# Altium project CONTROLLER_30.PrjPcb (part 1 of 3)
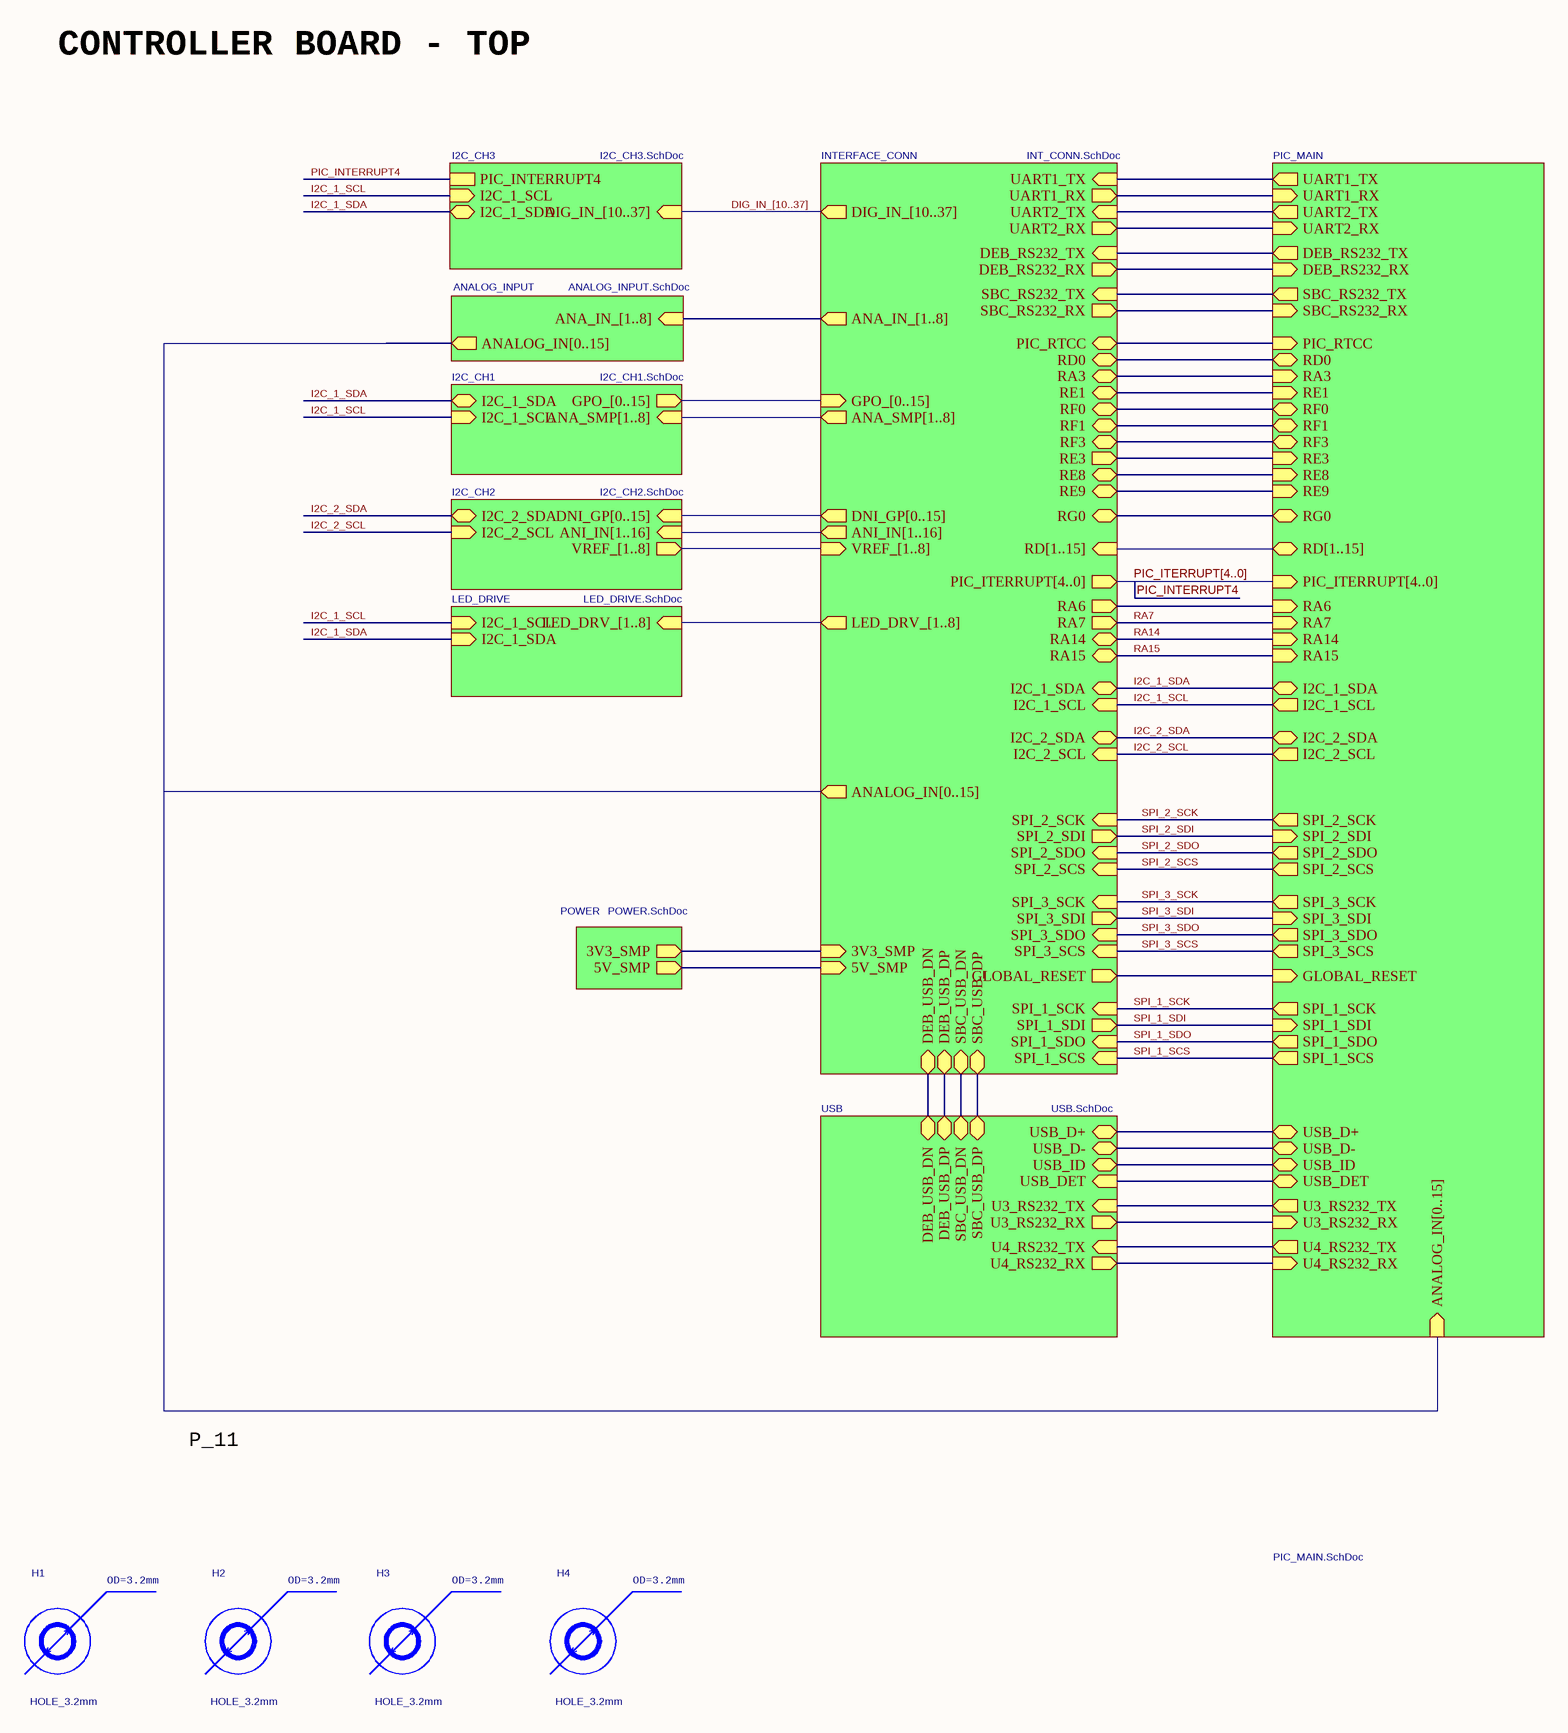
[diagram p0: CONTROLLER_TOP.SchDoc]
Approved_Date: 15/12/19; Designed_Date: 01/12/19; Reviewed_Date: 08/12/19
14 sheets, 671 parts. Net scope: hierarchical (ports join the sheet entries above them; power ports are global).
Board file: CONTROLLER-2_BRD2.PcbDoc
Sheets:
  CONTROLLER_TOP.SchDoc
    USB = USB.SchDoc
    LED_DRIVE = LED_DRIVE.SchDoc
    PIC_MAIN = PIC_MAIN.SchDoc
      PIC_BLOCK = PIC_BLOCK.SchDoc
        PIC_RS232 = PIC_RS232.SchDoc
        PIC_CONTROLLER = PIC_CONTROLLER.SchDoc
        PIC_POWER_MISC = PIC_POWER_MISC.SchDoc
    ANALOG_INPUT = ANALOG_INPUT.SchDoc
    POWER = POWER.SchDoc
    I2C_CH2 = I2C_CH2.SchDoc
    I2C_CH3 = I2C_CH3.SchDoc
    INTERFACE_CONN = INT_CONN.SchDoc
    I2C_CH1 = I2C_CH1.SchDoc

## Sheet CONTROLLER_TOP.SchDoc
size A3; ApprovedBy: D. Grossman; CheckedBy: G. Engel; Author: Y. Yakov; CompanyName: LightSense; DrawnBy: Y. Yakov; Engineer: Y.Yakov; Organization: LightSense

### Parts
H1  HOLE_3.2mm  [HOLE_3.2mm]
H2  HOLE_3.2mm  [HOLE_3.2mm]
H3  HOLE_3.2mm  [HOLE_3.2mm]
H4  HOLE_3.2mm  [HOLE_3.2mm]

### Sub-sheets
ANALOG_INPUT = ANALOG_INPUT.SchDoc: ANA_IN_[1..8] (in), ANALOG_IN[0..15] (out)
I2C_CH1 = I2C_CH1.SchDoc: I2C_1_SDA (bidir), I2C_1_SCL (in), ANA_SMP[1..8] (in), GPO_[0..15] (out)
I2C_CH2 = I2C_CH2.SchDoc: I2C_2_SCL (in), I2C_2_SDA (bidir), ANI_IN[1..16] (in), DNI_GP[0..15] (in), VREF_[1..8] (out)
I2C_CH3 = I2C_CH3.SchDoc: I2C_1_SCL (in), I2C_1_SDA (bidir), DIG_IN_[10..37] (in), PIC_INTERRUPT4
INTERFACE_CONN = INT_CONN.SchDoc: I2C_2_SDA (bidir), I2C_2_SCL (in), I2C_1_SDA (bidir), I2C_1_SCL (in), RE1 (bidir), RE8 (bidir), RE9 (bidir), RA15 (bidir), RA14 (bidir), PIC_RTCC (bidir), SBC_RS232_TX (in), DEB_RS232_RX (out), SBC_RS232_RX (out), SPI_2_SCK (in), SPI_3_SCK (in), SPI_2_SDI (out), SPI_3_SDI (out), SPI_2_SDO (in), SPI_3_SDO (in), SPI_2_SCS (in), SPI_3_SCS (in), RD0 (bidir), RF0 (bidir), RF1 (bidir), RF3 (bidir), RE3 (out), RA3 (bidir), SBC_USB_DP (bidir), SBC_USB_DN (bidir), DEB_USB_DP (bidir), DEB_USB_DN (bidir), LED_DRV_[1..8] (out), ANA_SMP[1..8] (out), GPO_[0..15] (in), ANI_IN[1..16] (out), VREF_[1..8] (in), RA7 (out), UART1_TX (in), UART2_TX (in), UART1_RX (out), UART2_RX (out), SPI_1_SCK (in), SPI_1_SDO (in), SPI_1_SCS (in), SPI_1_SDI (out), RG0 (bidir), PIC_ITERRUPT[4..0] (out), DNI_GP[0..15] (out), GLOBAL_RESET (out), ANA_IN_[1..8] (out), RA6 (out), DEB_RS232_TX (in), ANALOG_IN[0..15] (out), DIG_IN_[10..37] (out), RD[1..15] (in), 3V3_SMP (in), 5V_SMP (in)
LED_DRIVE = LED_DRIVE.SchDoc: I2C_1_SCL (in), I2C_1_SDA (in), LED_DRV_[1..8] (in)
PIC_MAIN = PIC_MAIN.SchDoc: USB_D- (bidir), PIC_ITERRUPT[4..0] (in), GLOBAL_RESET (in), USB_D+ (bidir), SPI_3_SDO (out), SPI_3_SCS (out), SPI_3_SDI (in), SPI_1_SCS (out), SPI_3_SCK (out), SPI_1_SDO (out), SPI_1_SCK (out), SPI_1_SDI (in), I2C_1_SDA (bidir), I2C_2_SDA (bidir), I2C_1_SCL (out), I2C_2_SCL (out), SBC_RS232_RX (in), SBC_RS232_TX (out), DEB_RS232_TX (out), RF0 (bidir), RF1 (bidir), RF3 (bidir), USB_ID (bidir), USB_DET (bidir), U3_RS232_RX (in), U3_RS232_TX (out), U4_RS232_RX (in), U4_RS232_TX (out), SPI_2_SCS (out), SPI_2_SDO (out), SPI_2_SCK (out), SPI_2_SDI (in), RD0 (bidir), RE1 (in), RE3 (in), UART1_RX (in), UART2_RX (in), UART1_TX (out), UART2_TX (out), RA7 (in), RE9 (in), RE8 (in), RA14 (in), RA15 (in), PIC_RTCC (in), RA6 (in), RA3 (in), RG0 (bidir), DEB_RS232_RX (in), ANALOG_IN[0..15] (in), RD[1..15] (bidir)
POWER = POWER.SchDoc: 5V_SMP (out), 3V3_SMP (out)
USB = USB.SchDoc: USB_D- (bidir), USB_D+ (bidir), U4_RS232_TX (in), U4_RS232_RX (out), U3_RS232_RX (out), U3_RS232_TX (in), SBC_USB_DP (bidir), SBC_USB_DN (bidir), DEB_USB_DP (bidir), DEB_USB_DN (bidir), USB_DET (in), USB_ID (bidir)

### Nets
3V3_SMP: sheet POWER/3V3_SMP, sheet INTERFACE_CONN/3V3_SMP
5V_SMP: sheet POWER/5V_SMP, sheet INTERFACE_CONN/5V_SMP
DEB_RS232_RX: sheet PIC_MAIN/DEB_RS232_RX, sheet INTERFACE_CONN/DEB_RS232_RX
DEB_RS232_TX: sheet PIC_MAIN/DEB_RS232_TX, sheet INTERFACE_CONN/DEB_RS232_TX
DEB_USB_DN: sheet USB/DEB_USB_DN, sheet INTERFACE_CONN/DEB_USB_DN
DEB_USB_DP: sheet USB/DEB_USB_DP, sheet INTERFACE_CONN/DEB_USB_DP
GLOBAL_RESET: sheet PIC_MAIN/GLOBAL_RESET, sheet INTERFACE_CONN/GLOBAL_RESET
I2C_1_SCL: sheet LED_DRIVE/I2C_1_SCL, sheet PIC_MAIN/I2C_1_SCL, sheet I2C_CH3/I2C_1_SCL, sheet INTERFACE_CONN/I2C_1_SCL, sheet I2C_CH1/I2C_1_SCL
I2C_1_SDA: sheet LED_DRIVE/I2C_1_SDA, sheet PIC_MAIN/I2C_1_SDA, sheet I2C_CH3/I2C_1_SDA, sheet INTERFACE_CONN/I2C_1_SDA, sheet I2C_CH1/I2C_1_SDA
I2C_2_SCL: sheet PIC_MAIN/I2C_2_SCL, sheet I2C_CH2/I2C_2_SCL, sheet INTERFACE_CONN/I2C_2_SCL
I2C_2_SDA: sheet PIC_MAIN/I2C_2_SDA, sheet I2C_CH2/I2C_2_SDA, sheet INTERFACE_CONN/I2C_2_SDA
PIC_RTCC: sheet PIC_MAIN/PIC_RTCC, sheet INTERFACE_CONN/PIC_RTCC
RA3: sheet PIC_MAIN/RA3, sheet INTERFACE_CONN/RA3
RA6: sheet PIC_MAIN/RA6, sheet INTERFACE_CONN/RA6
RA7: sheet PIC_MAIN/RA7, sheet INTERFACE_CONN/RA7
RA14: sheet PIC_MAIN/RA14, sheet INTERFACE_CONN/RA14
RA15: sheet PIC_MAIN/RA15, sheet INTERFACE_CONN/RA15
RD0: sheet PIC_MAIN/RD0, sheet INTERFACE_CONN/RD0
RE1: sheet PIC_MAIN/RE1, sheet INTERFACE_CONN/RE1
RE3: sheet PIC_MAIN/RE3, sheet INTERFACE_CONN/RE3
RE8: sheet PIC_MAIN/RE8, sheet INTERFACE_CONN/RE8
RE9: sheet PIC_MAIN/RE9, sheet INTERFACE_CONN/RE9
RF0: sheet PIC_MAIN/RF0, sheet INTERFACE_CONN/RF0
RF1: sheet PIC_MAIN/RF1, sheet INTERFACE_CONN/RF1
RF3: sheet PIC_MAIN/RF3, sheet INTERFACE_CONN/RF3
RG0: sheet PIC_MAIN/RG0, sheet INTERFACE_CONN/RG0
SBC_RS232_RX: sheet PIC_MAIN/SBC_RS232_RX, sheet INTERFACE_CONN/SBC_RS232_RX
SBC_RS232_TX: sheet PIC_MAIN/SBC_RS232_TX, sheet INTERFACE_CONN/SBC_RS232_TX
SBC_USB_DN: sheet USB/SBC_USB_DN, sheet INTERFACE_CONN/SBC_USB_DN
SBC_USB_DP: sheet USB/SBC_USB_DP, sheet INTERFACE_CONN/SBC_USB_DP
SPI_1_SCK: sheet PIC_MAIN/SPI_1_SCK, sheet INTERFACE_CONN/SPI_1_SCK
SPI_1_SCS: sheet PIC_MAIN/SPI_1_SCS, sheet INTERFACE_CONN/SPI_1_SCS
SPI_1_SDI: sheet PIC_MAIN/SPI_1_SDI, sheet INTERFACE_CONN/SPI_1_SDI
SPI_1_SDO: sheet PIC_MAIN/SPI_1_SDO, sheet INTERFACE_CONN/SPI_1_SDO
SPI_2_SCK: sheet PIC_MAIN/SPI_2_SCK, sheet INTERFACE_CONN/SPI_2_SCK
SPI_2_SCS: sheet PIC_MAIN/SPI_2_SCS, sheet INTERFACE_CONN/SPI_2_SCS
SPI_2_SDI: sheet PIC_MAIN/SPI_2_SDI, sheet INTERFACE_CONN/SPI_2_SDI
SPI_2_SDO: sheet PIC_MAIN/SPI_2_SDO, sheet INTERFACE_CONN/SPI_2_SDO
SPI_3_SCK: sheet PIC_MAIN/SPI_3_SCK, sheet INTERFACE_CONN/SPI_3_SCK
SPI_3_SCS: sheet PIC_MAIN/SPI_3_SCS, sheet INTERFACE_CONN/SPI_3_SCS
SPI_3_SDI: sheet PIC_MAIN/SPI_3_SDI, sheet INTERFACE_CONN/SPI_3_SDI
SPI_3_SDO: sheet PIC_MAIN/SPI_3_SDO, sheet INTERFACE_CONN/SPI_3_SDO
U3_RS232_RX: sheet USB/U3_RS232_RX, sheet PIC_MAIN/U3_RS232_RX
U3_RS232_TX: sheet USB/U3_RS232_TX, sheet PIC_MAIN/U3_RS232_TX
U4_RS232_RX: sheet USB/U4_RS232_RX, sheet PIC_MAIN/U4_RS232_RX
U4_RS232_TX: sheet USB/U4_RS232_TX, sheet PIC_MAIN/U4_RS232_TX
UART1_RX: sheet PIC_MAIN/UART1_RX, sheet INTERFACE_CONN/UART1_RX
UART1_TX: sheet PIC_MAIN/UART1_TX, sheet INTERFACE_CONN/UART1_TX
UART2_RX: sheet PIC_MAIN/UART2_RX, sheet INTERFACE_CONN/UART2_RX
UART2_TX: sheet PIC_MAIN/UART2_TX, sheet INTERFACE_CONN/UART2_TX
USB_D+: sheet USB/USB_D+, sheet PIC_MAIN/USB_D+
USB_D-: sheet USB/USB_D-, sheet PIC_MAIN/USB_D-
USB_DET: sheet USB/USB_DET, sheet PIC_MAIN/USB_DET
USB_ID: sheet USB/USB_ID, sheet PIC_MAIN/USB_ID

### Buses and harness runs
bus DIG_IN_[10..37] = sheet I2C_CH3/DIG_IN_[10..37] = sheet INTERFACE_CONN/DIG_IN_[10..37]
bus PIC_ITERRUPT[4..0] = sheet INTERFACE_CONN/PIC_ITERRUPT[4..0] = sheet PIC_MAIN/PIC_ITERRUPT[4..0]
bus sheet ANALOG_INPUT/ANA_IN_[1..8] = sheet INTERFACE_CONN/ANA_IN_[1..8]
bus sheet I2C_CH1/ANA_SMP[1..8] = sheet INTERFACE_CONN/ANA_SMP[1..8]
bus sheet I2C_CH1/GPO_[0..15] = sheet INTERFACE_CONN/GPO_[0..15]
bus sheet I2C_CH2/ANI_IN[1..16] = sheet INTERFACE_CONN/ANI_IN[1..16]
bus sheet I2C_CH2/DNI_GP[0..15] = sheet INTERFACE_CONN/DNI_GP[0..15]
bus sheet I2C_CH2/VREF_[1..8] = sheet INTERFACE_CONN/VREF_[1..8]
bus sheet INTERFACE_CONN/ANALOG_IN[0..15] = sheet PIC_MAIN/ANALOG_IN[0..15]
bus sheet INTERFACE_CONN/LED_DRV_[1..8] = sheet LED_DRIVE/LED_DRV_[1..8]
bus sheet INTERFACE_CONN/RD[1..15] = sheet PIC_MAIN/RD[1..15]

### Notes on the sheet
- CONTROLLER BOARD - TOP
- P_11
- Description:
- Sheet
- of
- Designed
- Name
- Signature
- Date
- File:
- This drawing and any accompanying documents contain confidential information intended for a specific individual and purpose.
  This information, owned by Lightsense, is private and confidential. If you are not the intended recipient, you are hereby notified that any disclosure, copying or distribution, or the taking of any action based on the contents of this information, is strictly prohibited.
- Board Name:
- Document Version:
- Approved
- Reviewed
- (in symbol HOLE_3.2mm) OD=3.2mm

## Sheet USB.SchDoc
size A3; ApprovedBy: D. Grossman; CheckedBy: G. Engel; Author: Y. Yakov; CompanyName: LightSense; DrawnBy: Y. Yakov; Engineer: Y.Yakov; Organization: LightSense
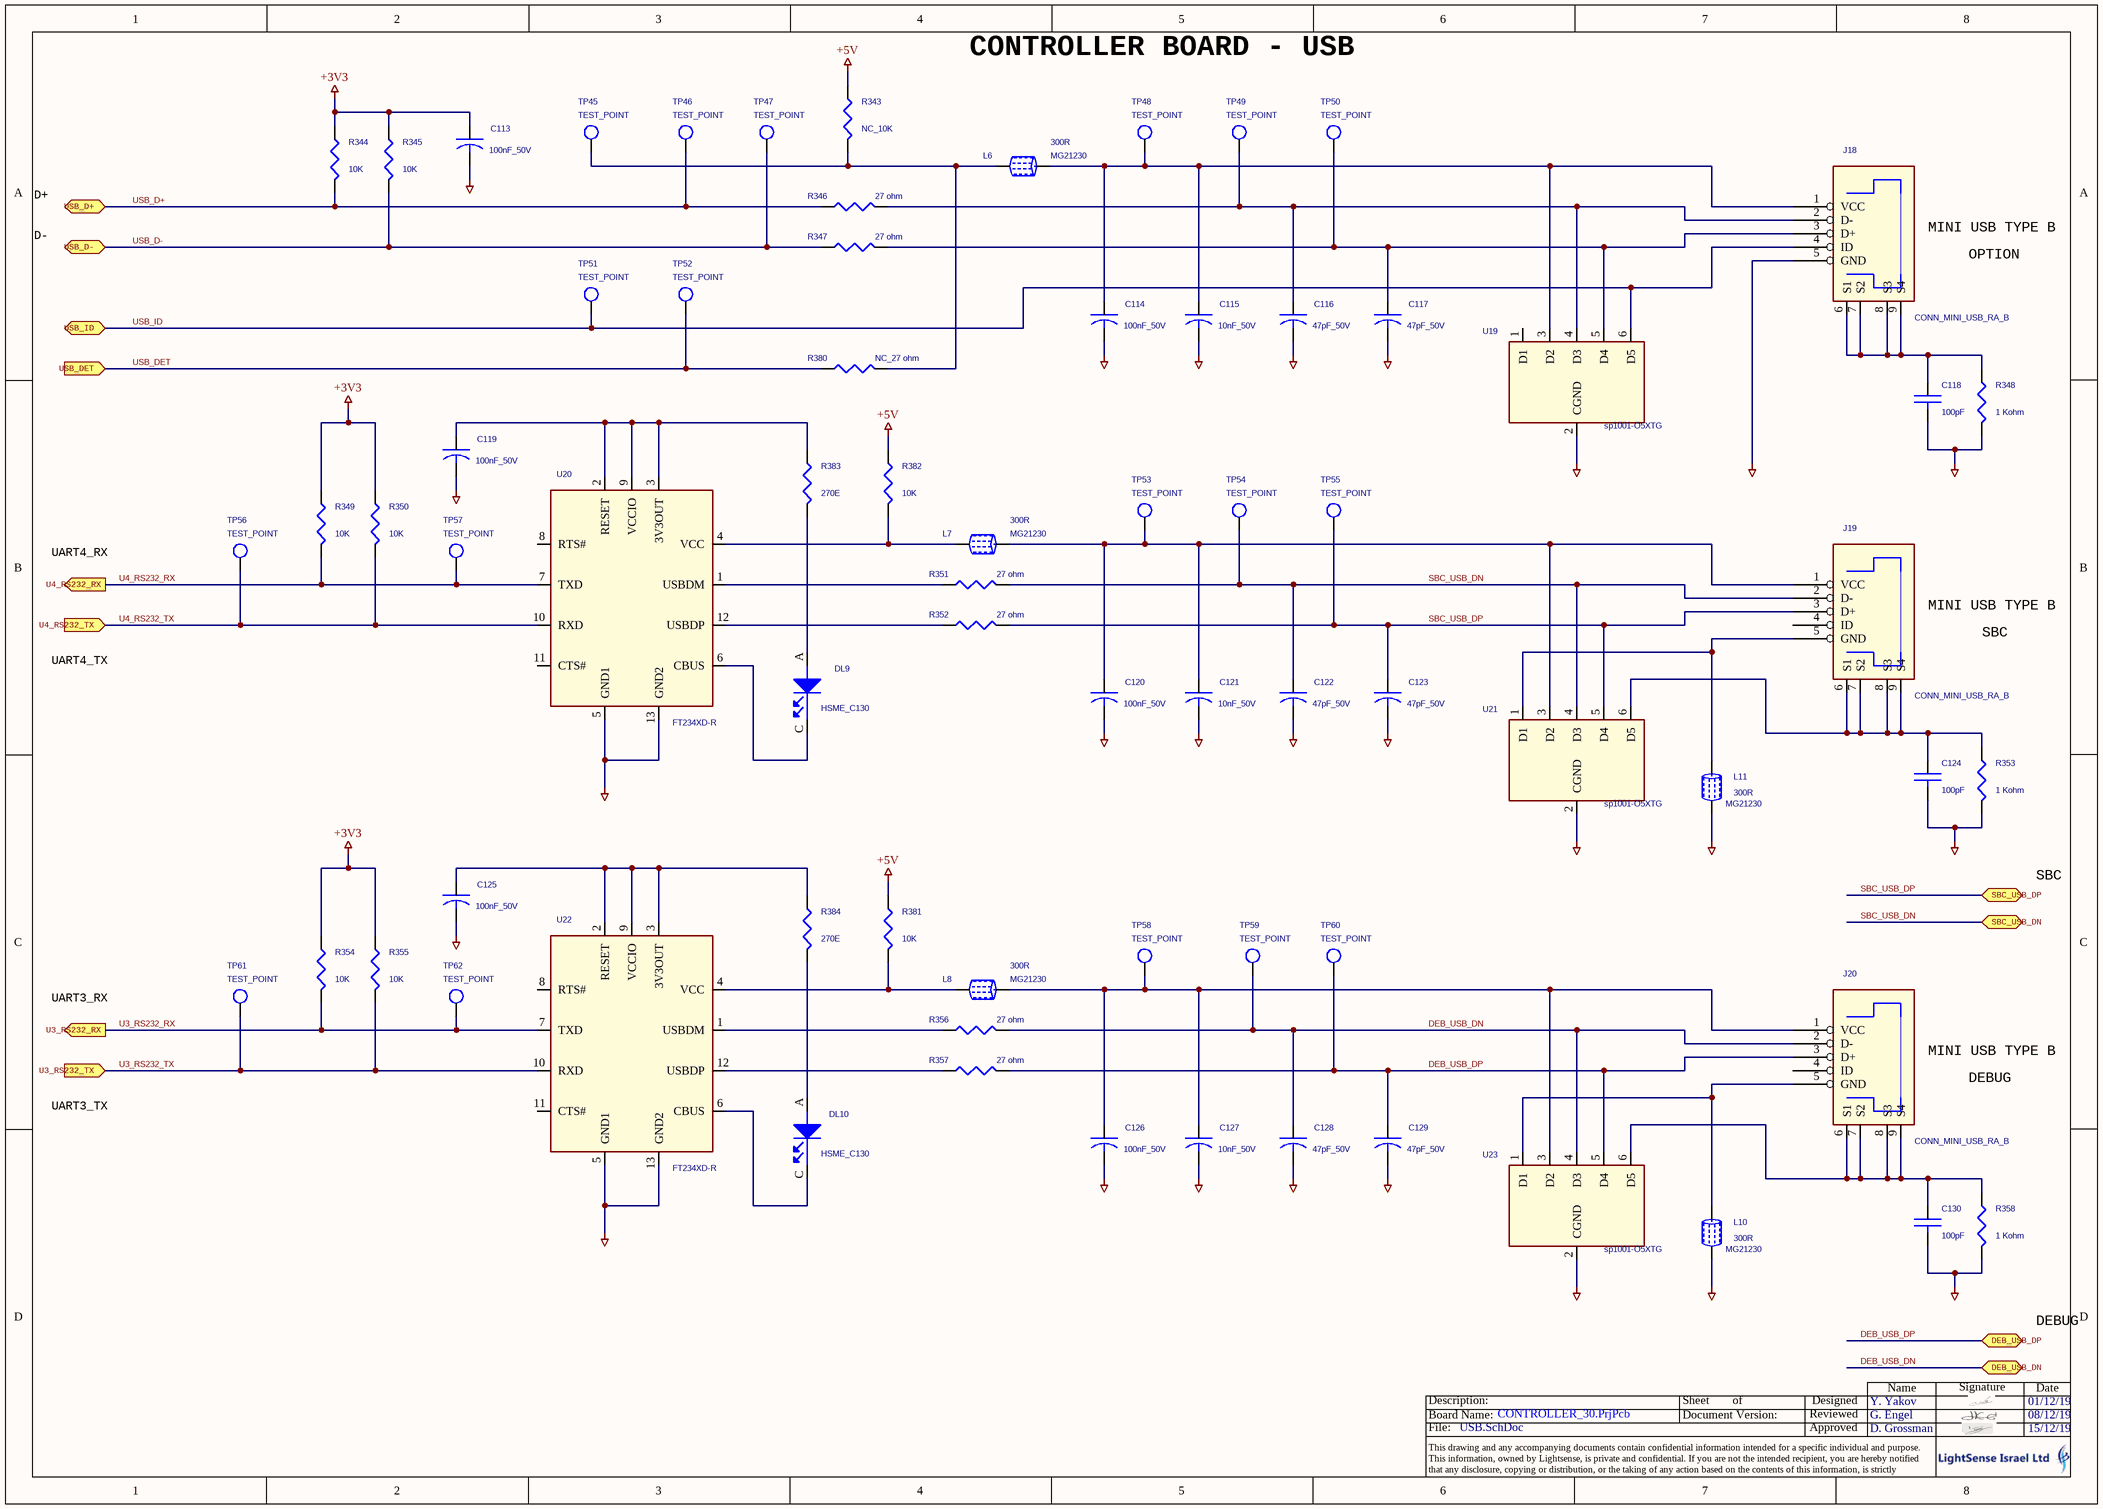
[diagram p1: USB.SchDoc]

### Parts
C113  100nF_50V  [0603]
C114  100nF_50V  [0603]
C115  10nF_50V  [0603]
C116  47pF_50V  [0603]
C117  47pF_50V  [0603]
C118  100pF  [C1206]
C119  100nF_50V  [0603]
C120  100nF_50V  [0603]
C121  10nF_50V  [0603]
C122  47pF_50V  [0603]
C123  47pF_50V  [0603]
C124  100pF  [C1206]
C125  100nF_50V  [0603]
C126  100nF_50V  [0603]
C127  10nF_50V  [0603]
C128  47pF_50V  [0603]
C129  47pF_50V  [0603]
C130  100pF  [C1206]
DL9  HSME_C130  [LED_0603]
DL10  HSME_C130  [LED_0603]
J18  CONN_MINI_USB_RA_B  [MUSB_B_9PIN]
J19  CONN_MINI_USB_RA_B  [MUSB_B_9PIN]
J20  CONN_MINI_USB_RA_B  [MUSB_B_9PIN]
L6  300R  Part_Number: MG21230  [B0603]
L7  300R  Part_Number: MG21230  [B0603]
L8  300R  Part_Number: MG21230  [B0603]
L10  300R  Part_Number: MG21230  [B0603]
L11  300R  Part_Number: MG21230  [B0603]
R343  NC_10K  [0603]
R344  10K  [0603]
R345  10K  [0603]
R346  27 ohm  [R0603]
R347  27 ohm  [R0603]
R348  1 Kohm  [R1206]
R349  10K  [0603]
R350  10K  [0603]
R351  27 ohm  [R0603]
R352  27 ohm  [R0603]
R353  1 Kohm  [R1206]
R354  10K  [0603]
R355  10K  [0603]
R356  27 ohm  [R0603]
R357  27 ohm  [R0603]
R358  1 Kohm  [R1206]
R380  NC_27 ohm  [R0603]
R381  10K  [0603]
R382  10K  [0603]
R383  270E  [0603]
R384  270E  [0603]
TP45  TEST_POINT  [TH_1mm]
TP46  TEST_POINT  [TH_1mm]
TP47  TEST_POINT  [TH_1mm]
TP48  TEST_POINT  [TH_1mm]
TP49  TEST_POINT  [TH_1mm]
TP50  TEST_POINT  [TH_1mm]
TP51  TEST_POINT  [TH_1mm]
TP52  TEST_POINT  [TH_1mm]
TP53  TEST_POINT  [TH_1mm]
TP54  TEST_POINT  [TH_1mm]
TP55  TEST_POINT  [TH_1mm]
TP56  TEST_POINT  [TH_1mm]
TP57  TEST_POINT  [TH_1mm]
TP58  TEST_POINT  [TH_1mm]
TP59  TEST_POINT  [TH_1mm]
TP60  TEST_POINT  [TH_1mm]
TP61  TEST_POINT  [TH_1mm]
TP62  TEST_POINT  [TH_1mm]
U19  sp1001-O5XTG  [SOT_563]
U20  FT234XD-R  [DFN_13]
U21  sp1001-O5XTG  [SOT_563]
U22  FT234XD-R  [DFN_13]
U23  sp1001-O5XTG  [SOT_563]

### Ports
DEB_USB_DN (bidir), DEB_USB_DP (bidir), SBC_USB_DN (bidir), SBC_USB_DP (bidir), U3_RS232_RX (out), U3_RS232_TX (in), U4_RS232_RX (out), U4_RS232_TX (in), USB_D+ (bidir), USB_D- (bidir), USB_DET (in), USB_ID (bidir)

### Nets
+3V3: C113.1 R344.1 R345.1 R349.1 R350.1 R354.1 R355.1
+5V: R343.1 R381.1 R382.1
GND_CPU: C113.2 C114.2 C115.2 C116.2 C117.2 C118.2 C119.2 C120.2 C121.2 C122.2 C123.2 C124.2 C125.2 C126.2 C127.2 C128.2 C129.2 C130.2 J18.5(GND) L10.1 L11.1 R348.2 R353.2 R358.2 U19.2(CGND) U20.5(GND1) U20.13(GND2) U21.2(CGND) U22.5(GND1) U22.13(GND2) U23.2(CGND)
DEB_USB_DN: C128.1 J20.2(D-) R356.2 TP59.1(TP) U23.4(D3) ; port DEB_USB_DN
DEB_USB_DP: C129.1 J20.3(D+) R357.2 TP60.1(TP) U23.5(D4) ; port DEB_USB_DP
SBC_USB_DN: C122.1 J19.2(D-) R351.2 TP54.1(TP) U21.4(D3) ; port SBC_USB_DN
SBC_USB_DP: C123.1 J19.3(D+) R352.2 TP55.1(TP) U21.5(D4) ; port SBC_USB_DP
U3_RS232_RX: R354.2 TP62.1(TP) U22.7(TXD) ; port U3_RS232_RX
U3_RS232_TX: R355.2 TP61.1(TP) U22.10(RXD) ; port U3_RS232_TX
U4_RS232_RX: R349.2 TP57.1(TP) U20.7(TXD) ; port U4_RS232_RX
U4_RS232_TX: R350.2 TP56.1(TP) U20.10(RXD) ; port U4_RS232_TX
USB_D+: R344.2 R346.1 TP46.1(TP) ; port USB_D+
USB_D-: R345.2 R347.1 TP47.1(TP) ; port USB_D-
USB_DET: R380.1 TP52.1(TP) ; port USB_DET
USB_ID: J18.4(ID) TP51.1(TP) U19.6(D5) ; port USB_ID
NetC114_1: C114.1 C115.1 J18.1(VCC) L6.2 TP48.1(TP) U19.3(D2)
NetC116_1: C116.1 J18.2(D-) R346.2 TP49.1(TP) U19.4(D3)
NetC117_1: C117.1 J18.3(D+) R347.2 TP50.1(TP) U19.5(D4)
NetC118_1: C118.1 J18.6(S1) J18.7(S2) J18.8(S3) J18.9(S4) R348.1
NetC119_1: C119.1 R383.1 U20.2(RESET) U20.3(3V3OUT) U20.9(VCCIO)
NetC120_1: C120.1 C121.1 J19.1(VCC) L7.2 TP53.1(TP) U21.3(D2)
NetC124_1: C124.1 J19.6(S1) J19.7(S2) J19.8(S3) J19.9(S4) R353.1 U21.6(D5)
NetC125_1: C125.1 R384.1 U22.2(RESET) U22.3(3V3OUT) U22.9(VCCIO)
NetC126_1: C126.1 C127.1 J20.1(VCC) L8.2 TP58.1(TP) U23.3(D2)
NetC130_1: C130.1 J20.6(S1) J20.7(S2) J20.8(S3) J20.9(S4) R358.1 U23.6(D5)
NetDL9_A: DL9.A(ANODE) R383.2
NetDL9_C: DL9.C(CATHODE) U20.6(CBUS)
NetDL10_A: DL10.A(ANODE) R384.2
NetDL10_C: DL10.C(CATHODE) U22.6(CBUS)
NetJ19_5: J19.5(GND) L11.2 U21.1(D1)
NetJ20_5: J20.5(GND) L10.2 U23.1(D1)
NetL6_1: L6.1 R343.2 R380.2 TP45.1(TP)
NetL7_1: L7.1 R382.2 U20.4(VCC)
NetL8_1: L8.1 R381.2 U22.4(VCC)
NetR351_1: R351.1 U20.1(USBDM)
NetR352_1: R352.1 U20.12(USBDP)
NetR356_1: R356.1 U22.1(USBDM)
NetR357_1: R357.1 U22.12(USBDP)

Not connected (* = marked no-connect by the designer): J19 4(ID); J20 4(ID); U19 1(D1); U20 8(RTS#) 11(CTS#); U22 8(RTS#) 11(CTS#)

### Notes on the sheet
- CONTROLLER BOARD - USB
- D+
- D-
- (near J18) MINI USB TYPE B
- OPTION
- UART4_RX
- (near J19) MINI USB TYPE B
- SBC
- UART4_TX
- UART3_RX
- (near J20) MINI USB TYPE B
- UART3_TX
- DEBUG
- Name
- Signature
- Date
- File:
- Board Name:
- Description:
- Document Version:
- Sheet
- of
- Approved
- Reviewed
- Designed
- This drawing and any accompanying documents contain confidential information intended for a specific individual and purpose.
  This information, owned by Lightsense, is private and confidential. If you are not the intended recipient, you are hereby notified that any disclosure, copying or distribution, or the taking of any action based on the contents of this information, is strictly prohibited.

### Library data of the parts
C113 C115 C116 C121 C122 C127 C128 = C: CAP_SMT_0603_50V_X7R_10%; MFG: KEMET; MFG_PN: C0603C104K5RAC
C114 C117 C119 C120 C123 C125 C126 C129 = C: CAP_SMT_0603_50V_X7R_10%; MFG_PN: C0603C104K5RAC; MFG: KEMET
C118 C124 C130 = C1206: Cap cer 100pF 5% 500V C0G 1206 smd; Part_Number: CP70050; NRX_PN: CE0130300
DL9 DL10 = LED: MFG: AVAGO; Lumenis_P/N: EL0000123; MFG_PN: HSME_C130
J18 = CONN_MINI_USB_RA_B: MFG_PN: MUSB-05-F-B-SM-A-TR; MFG: SAMTEC
J19 J20 = CONN_MINI_USB_RA_B: MFG: SAMTEC; MFG_PN: MUSB-05-F-B-SM-A-TR
L6-L8 L10 L11 = FERRITE BEAD2_0: Chip Bead Z 300 Ohm 0603 RoHS; NRX_PN: LE0010912
R343 R382 R383 = R_Dup1: MFG: YAGEO; MFG_PN: RC0603FR-0710K0L
R344 R345 R381 R384 = R_Dup1: MFG_PN: RC0603FR-0710K0L; MFG: YAGEO
R346 R347 R351 R352 R356 R357 R380 = R0603: Res 330 Ohm 5% 0603 RoHS; Part_Number: RS61410; NRX_PN: RE0100350
R348 R353 R358 = R1206: RES 1 Kohm 1% 1206 RoHS; Part_Number: RS00940; NRX_PN: RE0300400
R349 R354 = R_Dup1: MFG_PN: RC0603FR-0710KL; MFG: YAGEO
R350 R355 = R_Dup1: MFG: YAGEO; MFG_PN: RC0603FR-0710KL
TP45-TP62 = T POINT R_Dup1
U20 U22 = FT234XD-R_1: MFG: FTDI; MFG_PN: FT234XD-R

## Sheet LED_DRIVE.SchDoc
size A3; ApprovedBy: D. Grossman; CheckedBy: G. Engel; Author: Y. Yakov; CompanyName: LightSense; DrawnBy: Y. Yakov; Engineer: Y.Yakov; Organization: LightSense
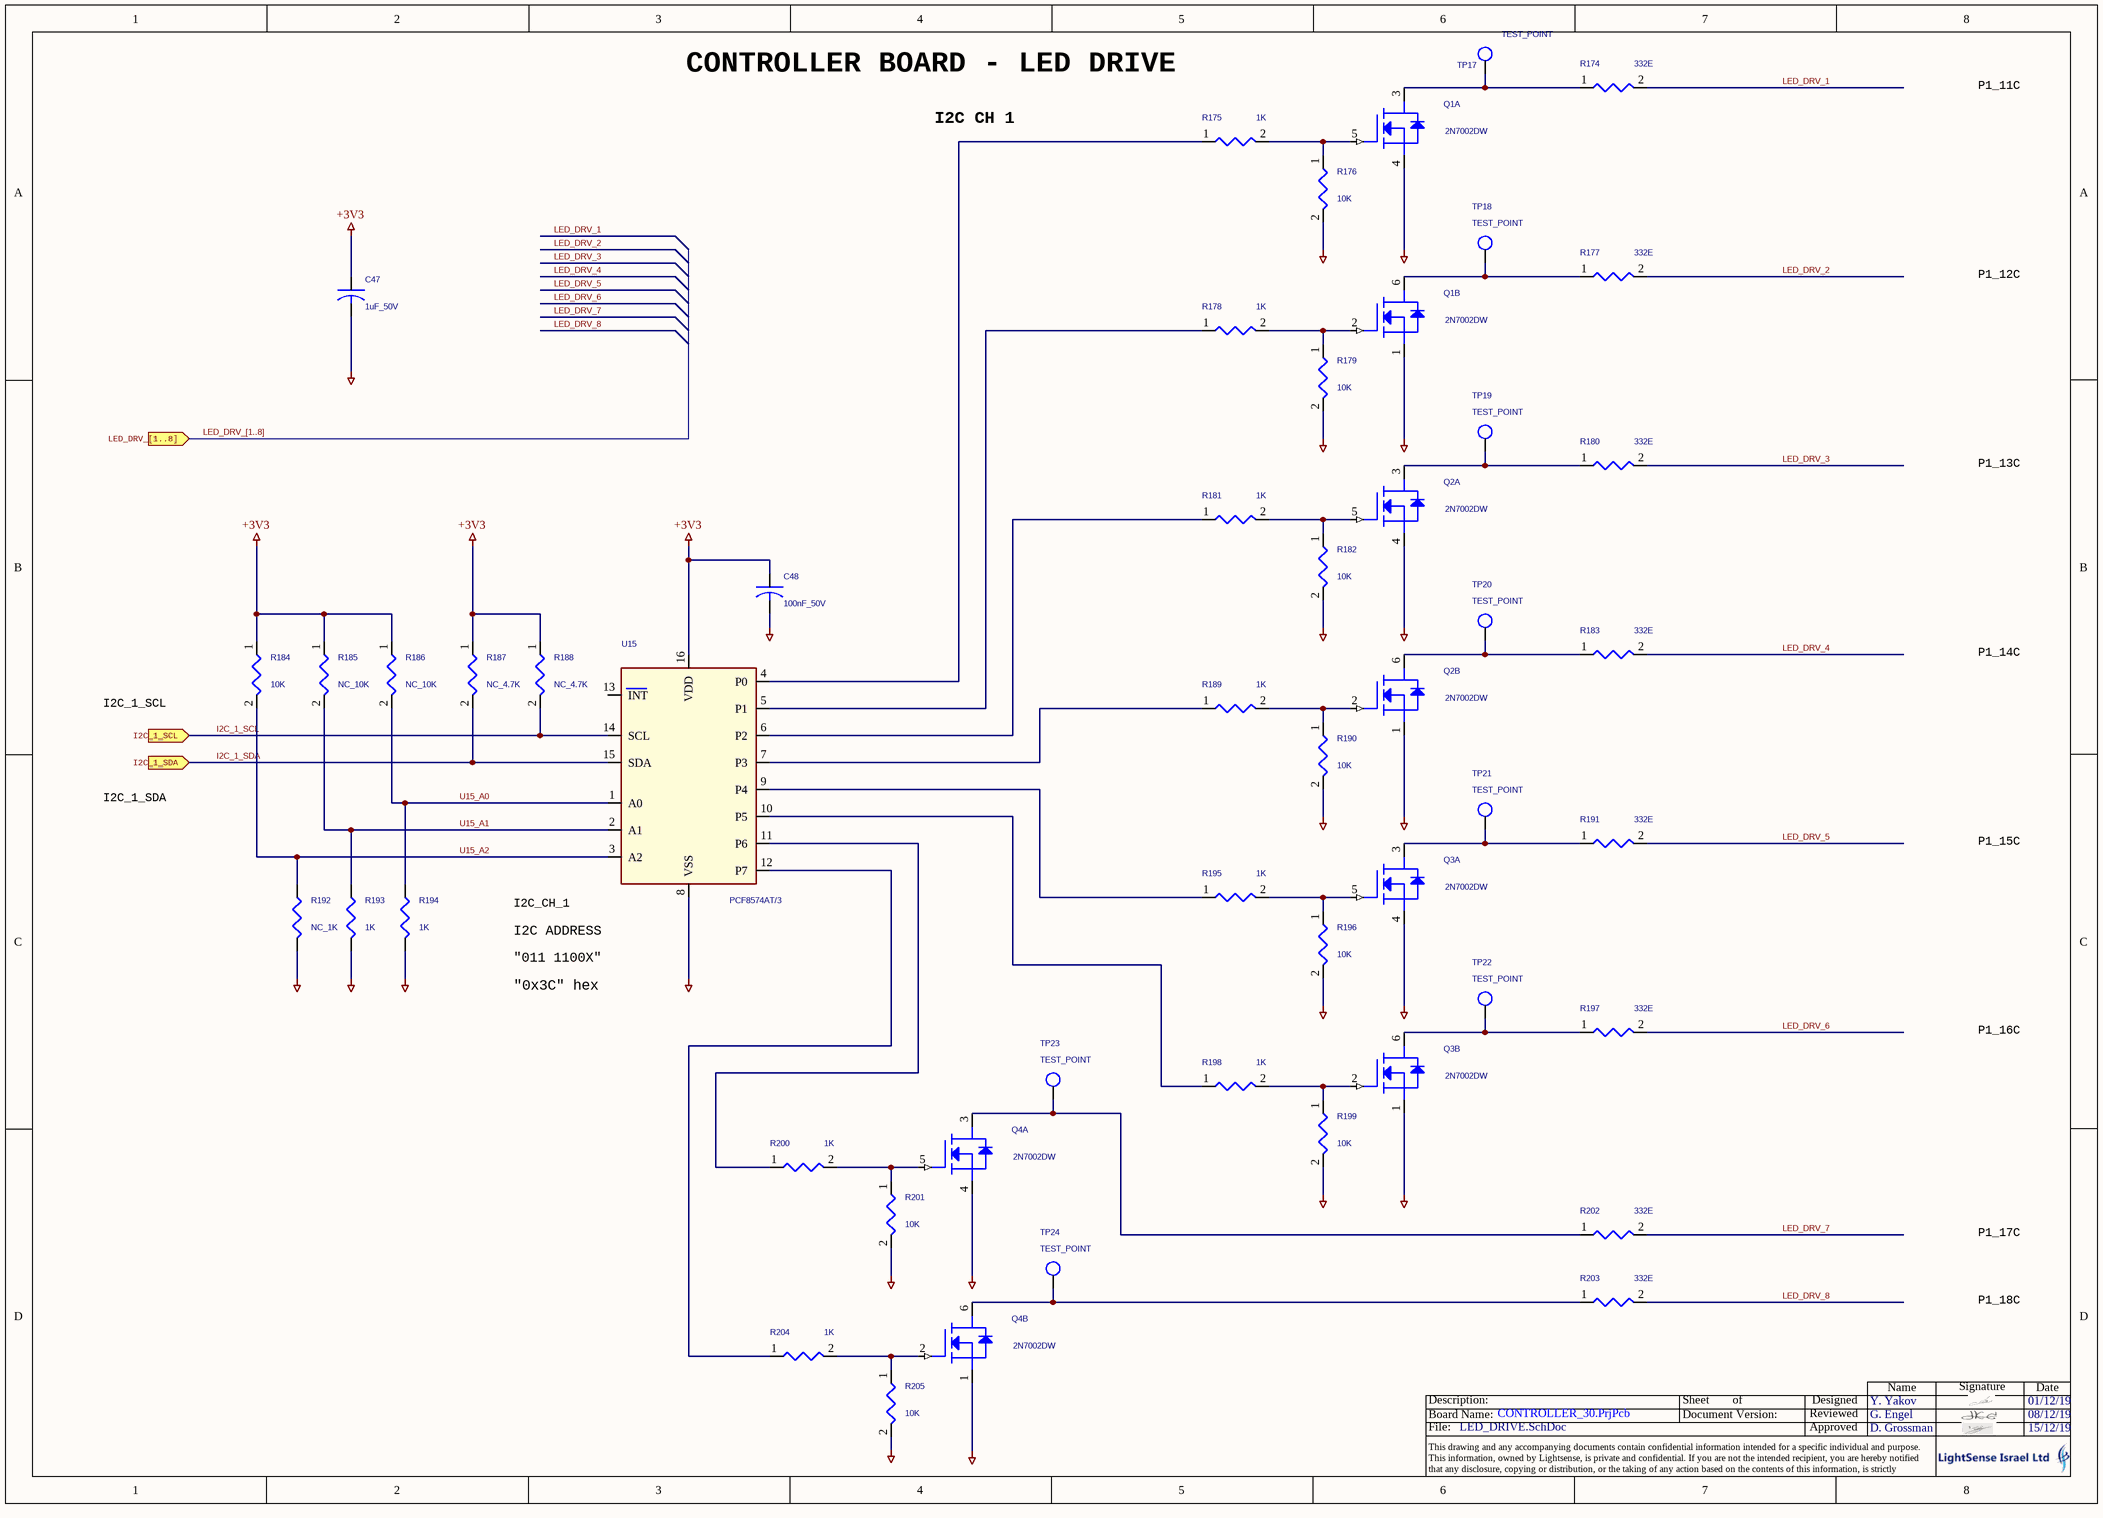
[diagram p2: LED_DRIVE.SchDoc]

### Parts
C47  1uF_50V  [0805]
C48  100nF_50V  [0603]
Q1  2N7002DW  [SOT_363]  (parts A,B of 2)
Q2  2N7002DW  [SOT_363]  (parts A,B of 2)
Q3  2N7002DW  [SOT_363]  (parts A,B of 2)
Q4  2N7002DW  [SOT_363]  (parts A,B of 2)
R174  332E  [R0603]
R175  1K  [R0603]
R176  10K  [R0603]
R177  332E  [R0603]
R178  1K  [R0603]
R179  10K  [R0603]
R180  332E  [R0603]
R181  1K  [R0603]
R182  10K  [R0603]
R183  332E  [R0603]
R184  10K  [R0603]
R185  NC_10K  [R0603]
R186  NC_10K  [R0603]
R187  NC_4.7K  [R0603]
R188  NC_4.7K  [R0603]
R189  1K  [R0603]
R190  10K  [R0603]
R191  332E  [R0603]
R192  NC_1K  [0603]
R193  1K  [0603]
R194  1K  [0603]
R195  1K  [R0603]
R196  10K  [R0603]
R197  332E  [R0603]
R198  1K  [R0603]
R199  10K  [R0603]
R200  1K  [R0603]
R201  10K  [R0603]
R202  332E  [R0603]
R203  332E  [R0603]
R204  1K  [R0603]
R205  10K  [R0603]
TP17  TEST_POINT  [TH_1mm]
TP18  TEST_POINT  [TH_1mm]
TP19  TEST_POINT  [TH_1mm]
TP20  TEST_POINT  [TH_1mm]
TP21  TEST_POINT  [TH_1mm]
TP22  TEST_POINT  [TH_1mm]
TP23  TEST_POINT  [TH_1mm]
TP24  TEST_POINT  [TH_1mm]
U15  PCF8574AT/3  [SO_16]

### Ports
I2C_1_SCL (in), I2C_1_SDA (in), LED_DRV_[1..8] (in)

### Nets
+3V3: C47.1 C48.1 R184.1 R185.1 R186.1 R187.1 R188.1 U15.16(VDD)
GND_CPU: C47.2 C48.2 Q1.1(SOURCE) Q1.4(SOURCE) Q2.1(SOURCE) Q2.4(SOURCE) Q3.1(SOURCE) Q3.4(SOURCE) Q4.1(SOURCE) Q4.4(SOURCE) R176.2 R179.2 R182.2 R190.2 R192.2 R193.2 R194.2 R196.2 R199.2 R201.2 R205.2 U15.8(VSS)
I2C_1_SCL: R188.2 U15.14(SCL) ; port I2C_1_SCL
I2C_1_SDA: R187.2 U15.15(SDA) ; port I2C_1_SDA
LED_DRV_1: R174.2
LED_DRV_2: R177.2
LED_DRV_3: R180.2
LED_DRV_4: R183.2
LED_DRV_5: R191.2
LED_DRV_6: R197.2
LED_DRV_7: R202.2
LED_DRV_8: R203.2
U15_A0: R186.2 R194.1 U15.1(A0)
U15_A1: R185.2 R193.1 U15.2(A1)
U15_A2: R184.2 R192.1 U15.3(A2)
NetQ1_2: Q1.2(GATE) R178.2 R179.1
NetQ1_3: Q1.3(DRAIN) R174.1 TP17.1(TP)
NetQ1_5: Q1.5(GATE) R175.2 R176.1
NetQ1_6: Q1.6(DRAIN) R177.1 TP18.1(TP)
NetQ2_2: Q2.2(GATE) R189.2 R190.1
NetQ2_3: Q2.3(DRAIN) R180.1 TP19.1(TP)
NetQ2_5: Q2.5(GATE) R181.2 R182.1
NetQ2_6: Q2.6(DRAIN) R183.1 TP20.1(TP)
NetQ3_2: Q3.2(GATE) R198.2 R199.1
NetQ3_3: Q3.3(DRAIN) R191.1 TP21.1(TP)
NetQ3_5: Q3.5(GATE) R195.2 R196.1
NetQ3_6: Q3.6(DRAIN) R197.1 TP22.1(TP)
NetQ4_2: Q4.2(GATE) R204.2 R205.1
NetQ4_3: Q4.3(DRAIN) R202.1 TP23.1(TP)
NetQ4_5: Q4.5(GATE) R200.2 R201.1
NetQ4_6: Q4.6(DRAIN) R203.1 TP24.1(TP)
NetR175_1: R175.1 U15.4(P0)
NetR178_1: R178.1 U15.5(P1)
NetR181_1: R181.1 U15.6(P2)
NetR189_1: R189.1 U15.7(P3)
NetR195_1: R195.1 U15.9(P4)
NetR198_1: R198.1 U15.10(P5)
NetR200_1: R200.1 U15.11(P6)
NetR204_1: R204.1 U15.12(P7)

Not connected (* = marked no-connect by the designer): U15 13(INT)

### Buses and harness runs
bus LED_DRV_[1..8] = port LED_DRV_[1..8]

### Notes on the sheet
- CONTROLLER BOARD - LED DRIVE
- P1_11C
- I2C CH 1
- P1_12C
- P1_13C
- I2C_1_SCL
- P1_14C
- I2C_1_SDA
- P1_15C
- I2C_CH_1
- (near U15) I2C ADDRESS
- "0x3C" hex
- "011 1100X"
- P1_16C
- P1_17C
- P1_18C
- Name
- Signature
- Date
- File:
- Board Name:
- Description:
- Document Version:
- Sheet
- of
- Approved
- Reviewed
- Designed
- This drawing and any accompanying documents contain confidential information intended for a specific individual and purpose.
  This information, owned by Lightsense, is private and confidential. If you are not the intended recipient, you are hereby notified that any disclosure, copying or distribution, or the taking of any action based on the contents of this information, is strictly prohibited.

### Library data of the parts
C47 = CAP: a; Mnfctr_Part_Number: TCJT106M016R0150; MFG: Murata; MFG_PN: GRM21BR60J106K
C48 = C: as C113 on sheet USB
Q1-Q3 = 2N7002DW: MFG: DIODES; MFG_PN: 2N7002DW-7-F
Q4 = 2N7002DW: MFG_PN: 2N7002DW-7-F; MFG: DIODES
R174 R177 R180 R183 R191 R197 R202 R203 = R: MFG: YAGEO; MFG_PN: RC0603FR-07332RL
R175 R178 R181 R189 R195 R198 = R: MFG_PN: RC0603FR-071KL; MFG: YAGEO
R176 R179 R182 R184-R186 R188 R190 R196 R199 = R: MFG_PN: RC0603FR-0710KL; MFG: YAGEO
R187 R201 R205 = R: MFG: YAGEO; MFG_PN: RC0603FR-0710KL
R192 = R_Dup1: MFG_PN: RC0603FR-071K00L; MFG: YAGEO
R193 R194 = R_Dup1: MFG: YAGEO; MFG_PN: RC0603FR-071K00L
R200 R204 = R: MFG: YAGEO; MFG_PN: RC0603FR-071KL
TP17-TP22 = T POINT R: MFG_PN: N.A.; MFG: N.A.
TP23 TP24 = T POINT R: MFG: N.A.; MFG_PN: N.A.
U15 = PCF8574_0: PORT I2C, 8Bit, SO_16; MFG: NXP; MFG_PN: PCF8574AT/3

## Sheet PIC_MAIN.SchDoc
size A3; ApprovedBy: D. Grossman; CheckedBy: G. Engel; Author: Y. Yakov; CompanyName: LightSense; DrawnBy: Y. Yakov; Engineer: Y.Yakov; Organization: LightSense
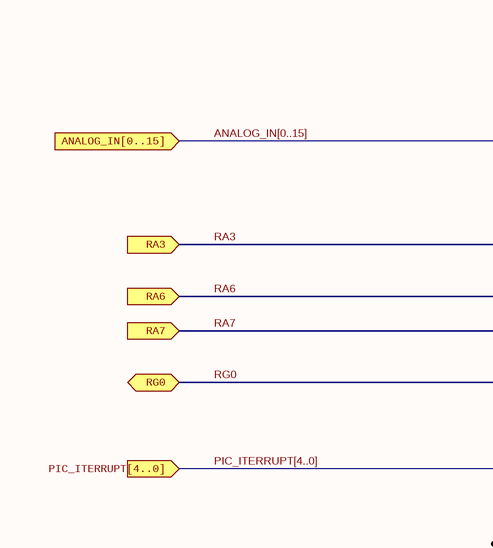
[diagram p3: PIC_MAIN.SchDoc, top left]
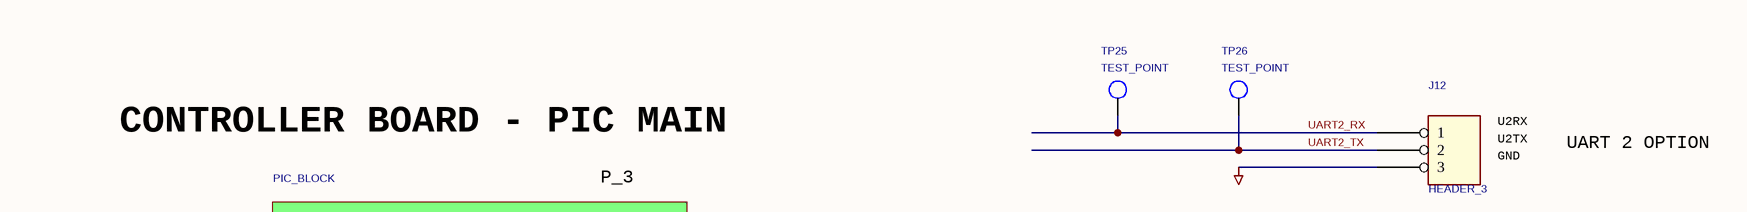
[diagram p4: PIC_MAIN.SchDoc, top right]
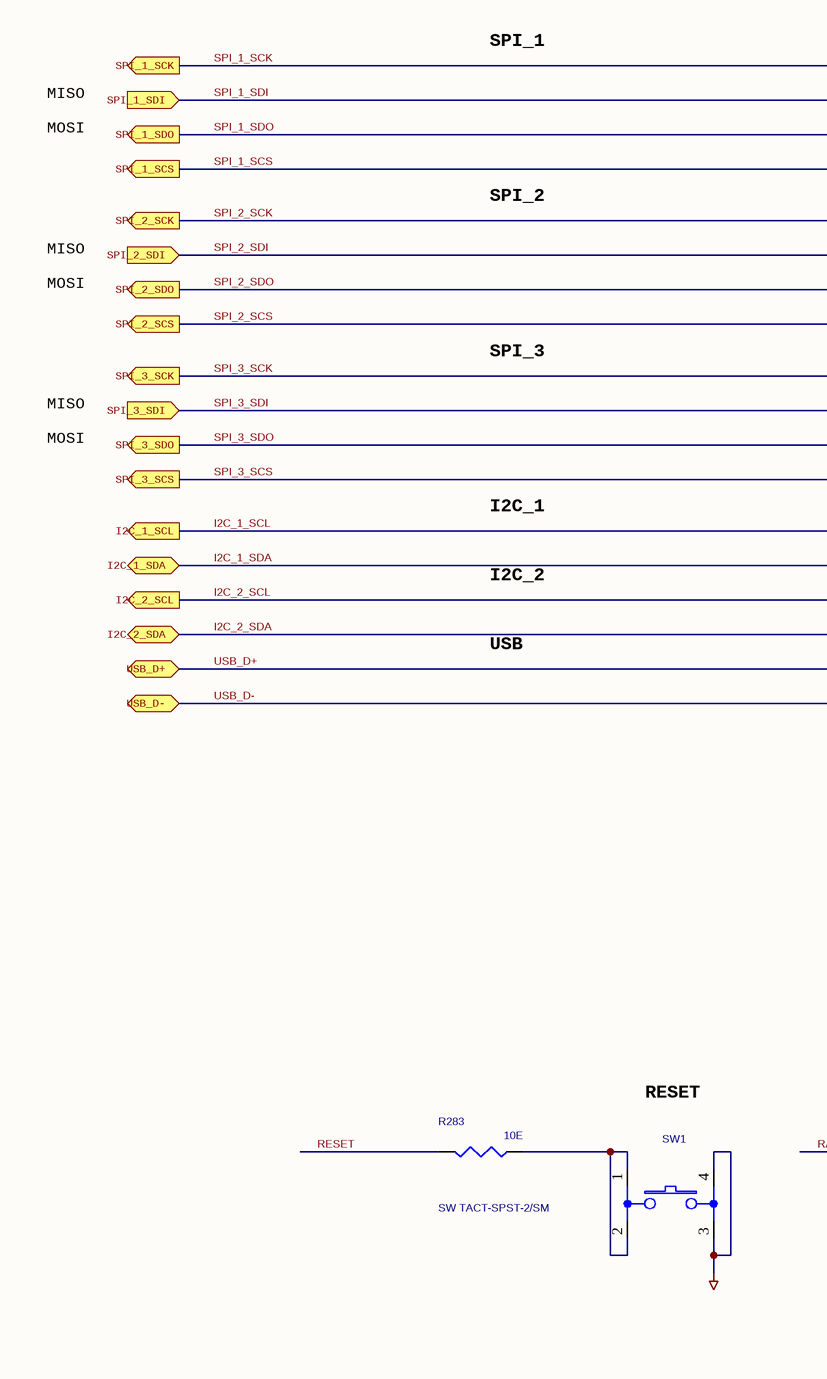
[diagram p5: PIC_MAIN.SchDoc, bottom left]
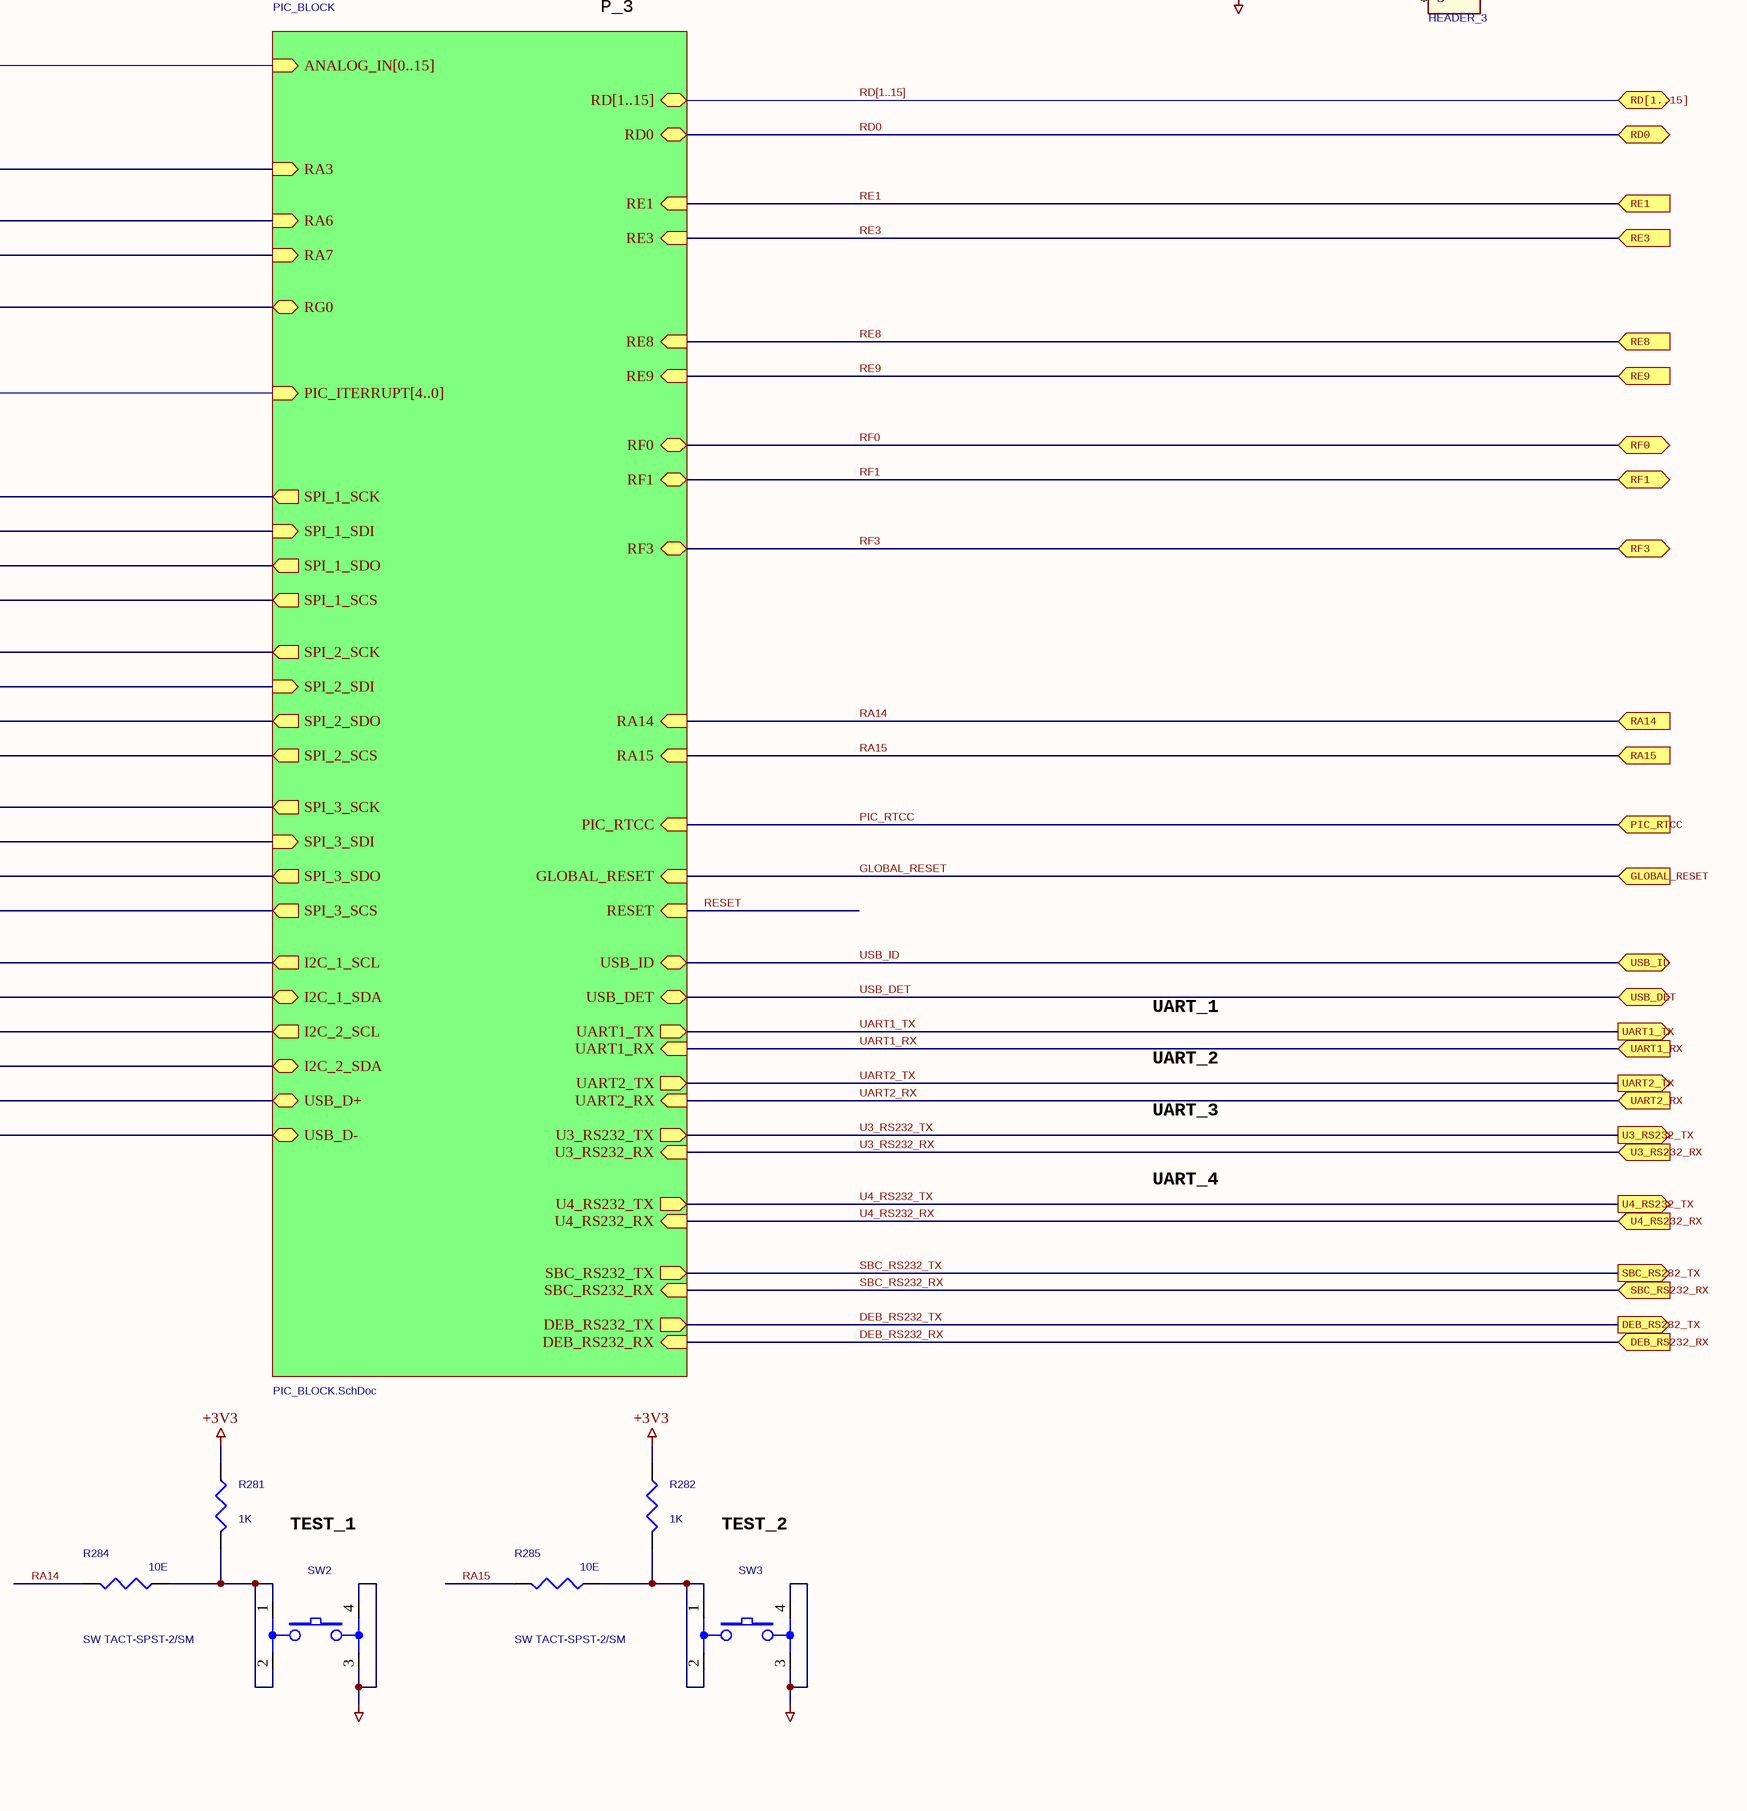
[diagram p6: PIC_MAIN.SchDoc, bottom right]

### Parts
J12  HEADER_3  [TH_3pin_100mil]
R281  1K  [0603]
R282  1K  [0603]
R283  10E  [0603]
R284  10E  [0603]
R285  10E  [0603]
SW1  SW TACT-SPST-2/SM  [SMT_4PIN]
SW2  SW TACT-SPST-2/SM  [SMT_4PIN]
SW3  SW TACT-SPST-2/SM  [SMT_4PIN]
TP25  TEST_POINT  [TH_1mm]
TP26  TEST_POINT  [TH_1mm]

### Sub-sheets
PIC_BLOCK = PIC_BLOCK.SchDoc: GLOBAL_RESET (in), ANALOG_IN[0..15] (in), RESET (in), I2C_2_SDA (bidir), I2C_1_SDA (bidir), I2C_2_SCL (out), I2C_1_SCL (out), SPI_3_SDO (out), SPI_3_SCS (out), SPI_3_SDI (in), SPI_3_SCK (out), SPI_2_SCS (out), SPI_2_SDO (out), SPI_2_SDI (in), SPI_2_SCK (out), SBC_RS232_TX (out), SBC_RS232_RX (in), DEB_RS232_TX (out), DEB_RS232_RX (in), PIC_ITERRUPT[4..0] (in), RD[1..15] (bidir), RD0 (bidir), RF0 (bidir), RF1 (bidir), RF3 (bidir), USB_DET (bidir), U4_RS232_RX (in), U4_RS232_TX (out), U3_RS232_TX (out), U3_RS232_RX (in), USB_D+ (bidir), USB_D- (bidir), RE1 (in), RE3 (in), RE8 (in), RE9 (in), USB_ID (bidir), RA3 (in), RA14 (in), RA15 (in), UART1_RX (in), UART2_RX (in), UART1_TX (out), UART2_TX (out), RA6 (in), RA7 (in), SPI_1_SCS (out), SPI_1_SDO (out), SPI_1_SDI (in), SPI_1_SCK (out), PIC_RTCC (in), RG0 (bidir)

### Ports
ANALOG_IN[0..15] (in), DEB_RS232_RX (in), DEB_RS232_TX (out), GLOBAL_RESET (in), I2C_1_SCL (out), I2C_1_SDA (bidir), I2C_2_SCL (out), I2C_2_SDA (bidir), PIC_ITERRUPT[4..0] (in), PIC_RTCC (in), RA3 (in), RA6 (in), RA7 (in), RA14 (in), RA15 (in), RD0 (bidir), RD[1..15] (bidir), RE1 (in), RE3 (in), RE8 (in), RE9 (in), RF0 (bidir), RF1 (bidir), RF3 (bidir), RG0 (bidir), SBC_RS232_RX (in), SBC_RS232_TX (out), SPI_1_SCK (out), SPI_1_SCS (out), SPI_1_SDI (in), SPI_1_SDO (out), SPI_2_SCK (out), SPI_2_SCS (out), SPI_2_SDI (in), SPI_2_SDO (out), SPI_3_SCK (out), SPI_3_SCS (out), SPI_3_SDI (in), SPI_3_SDO (out), U3_RS232_RX (in), U3_RS232_TX (out), U4_RS232_RX (in), U4_RS232_TX (out), UART1_RX (in), UART1_TX (out), UART2_RX (in), UART2_TX (out), USB_D+ (bidir), USB_D- (bidir), USB_DET (bidir), USB_ID (bidir)

### Nets
+3V3: R281.1 R282.1
GND_CPU: J12.3 SW1.3 SW1.4 SW2.3 SW2.4 SW3.3 SW3.4
DEB_RS232_RX: port DEB_RS232_RX, sheet PIC_BLOCK/DEB_RS232_RX
DEB_RS232_TX: port DEB_RS232_TX, sheet PIC_BLOCK/DEB_RS232_TX
GLOBAL_RESET: port GLOBAL_RESET, sheet PIC_BLOCK/GLOBAL_RESET
I2C_1_SCL: port I2C_1_SCL, sheet PIC_BLOCK/I2C_1_SCL
I2C_1_SDA: port I2C_1_SDA, sheet PIC_BLOCK/I2C_1_SDA
I2C_2_SCL: port I2C_2_SCL, sheet PIC_BLOCK/I2C_2_SCL
I2C_2_SDA: port I2C_2_SDA, sheet PIC_BLOCK/I2C_2_SDA
PIC_RTCC: port PIC_RTCC, sheet PIC_BLOCK/PIC_RTCC
RA3: port RA3, sheet PIC_BLOCK/RA3
RA6: port RA6, sheet PIC_BLOCK/RA6
RA7: port RA7, sheet PIC_BLOCK/RA7
RA14: R284.2 ; port RA14, sheet PIC_BLOCK/RA14
RA15: R285.2 ; port RA15, sheet PIC_BLOCK/RA15
RD0: port RD0, sheet PIC_BLOCK/RD0
RE1: port RE1, sheet PIC_BLOCK/RE1
RE3: port RE3, sheet PIC_BLOCK/RE3
RE8: port RE8, sheet PIC_BLOCK/RE8
RE9: port RE9, sheet PIC_BLOCK/RE9
RESET: R283.2 ; sheet PIC_BLOCK/RESET
RF0: port RF0, sheet PIC_BLOCK/RF0
RF1: port RF1, sheet PIC_BLOCK/RF1
RF3: port RF3, sheet PIC_BLOCK/RF3
RG0: port RG0, sheet PIC_BLOCK/RG0
SBC_RS232_RX: port SBC_RS232_RX, sheet PIC_BLOCK/SBC_RS232_RX
SBC_RS232_TX: port SBC_RS232_TX, sheet PIC_BLOCK/SBC_RS232_TX
SPI_1_SCK: port SPI_1_SCK, sheet PIC_BLOCK/SPI_1_SCK
SPI_1_SCS: port SPI_1_SCS, sheet PIC_BLOCK/SPI_1_SCS
SPI_1_SDI: port SPI_1_SDI, sheet PIC_BLOCK/SPI_1_SDI
SPI_1_SDO: port SPI_1_SDO, sheet PIC_BLOCK/SPI_1_SDO
SPI_2_SCK: port SPI_2_SCK, sheet PIC_BLOCK/SPI_2_SCK
SPI_2_SCS: port SPI_2_SCS, sheet PIC_BLOCK/SPI_2_SCS
SPI_2_SDI: port SPI_2_SDI, sheet PIC_BLOCK/SPI_2_SDI
SPI_2_SDO: port SPI_2_SDO, sheet PIC_BLOCK/SPI_2_SDO
SPI_3_SCK: port SPI_3_SCK, sheet PIC_BLOCK/SPI_3_SCK
SPI_3_SCS: port SPI_3_SCS, sheet PIC_BLOCK/SPI_3_SCS
SPI_3_SDI: port SPI_3_SDI, sheet PIC_BLOCK/SPI_3_SDI
SPI_3_SDO: port SPI_3_SDO, sheet PIC_BLOCK/SPI_3_SDO
U3_RS232_RX: port U3_RS232_RX, sheet PIC_BLOCK/U3_RS232_RX
U3_RS232_TX: port U3_RS232_TX, sheet PIC_BLOCK/U3_RS232_TX
U4_RS232_RX: port U4_RS232_RX, sheet PIC_BLOCK/U4_RS232_RX
U4_RS232_TX: port U4_RS232_TX, sheet PIC_BLOCK/U4_RS232_TX
UART1_RX: port UART1_RX, sheet PIC_BLOCK/UART1_RX
UART1_TX: port UART1_TX, sheet PIC_BLOCK/UART1_TX
UART2_RX: J12.1 TP25.1(TP) ; port UART2_RX, sheet PIC_BLOCK/UART2_RX
UART2_TX: J12.2 TP26.1(TP) ; port UART2_TX, sheet PIC_BLOCK/UART2_TX
USB_D+: port USB_D+, sheet PIC_BLOCK/USB_D+
USB_D-: port USB_D-, sheet PIC_BLOCK/USB_D-
USB_DET: port USB_DET, sheet PIC_BLOCK/USB_DET
USB_ID: port USB_ID, sheet PIC_BLOCK/USB_ID
NetR281_2: R281.2 R284.1 SW2.1 SW2.2
NetR282_2: R282.2 R285.1 SW3.1 SW3.2
NetR283_1: R283.1 SW1.1 SW1.2

### Buses and harness runs
bus ANALOG_IN[0..15] = port ANALOG_IN[0..15] = sheet PIC_BLOCK/ANALOG_IN[0..15]
bus PIC_ITERRUPT[4..0] = port PIC_ITERRUPT[4..0] = sheet PIC_BLOCK/PIC_ITERRUPT[4..0]
bus RD[1..15] = port RD[1..15] = sheet PIC_BLOCK/RD[1..15]

### Notes on the sheet
- CONTROLLER BOARD - PIC MAIN
- U2TX
- U2RX
- UART 2 OPTION
- P_3
- GND
- SPI_1
- MOSI
- MISO
- SPI_2
- SPI_3
- I2C_2
- I2C_1
- UART_1
- USB
- UART_2
- UART_3
- UART_4
- RESET
- TEST_1
- TEST_2
- Name
- Signature
- Date
- File:
- Board Name:
- Description:
- Document Version:
- Sheet
- of
- Approved
- Reviewed
- Designed
- This drawing and any accompanying documents contain confidential information intended for a specific individual and purpose.
  This information, owned by Lightsense, is private and confidential. If you are not the intended recipient, you are hereby notified that any disclosure, copying or distribution, or the taking of any action based on the contents of this information, is strictly prohibited.

### Library data of the parts
J12 = HEADER 3
R281 R282 = R_Dup1: MFG: YAGEO; MFG_PN: RC0603FR-071K00L
R283-R285 = R_Dup1: MFG_PN: RC0603FR-0710R0L; MFG: YAGEO
TP25 TP26 = T POINT R_Dup1

## Sheet PIC_BLOCK.SchDoc
size A3; ApprovedBy: D. Grossman; CheckedBy: G. Engel; Author: Y. Yakov; CompanyName: LightSense; DrawnBy: Y. Yakov; Engineer: Y.Yakov; Organization: LightSense
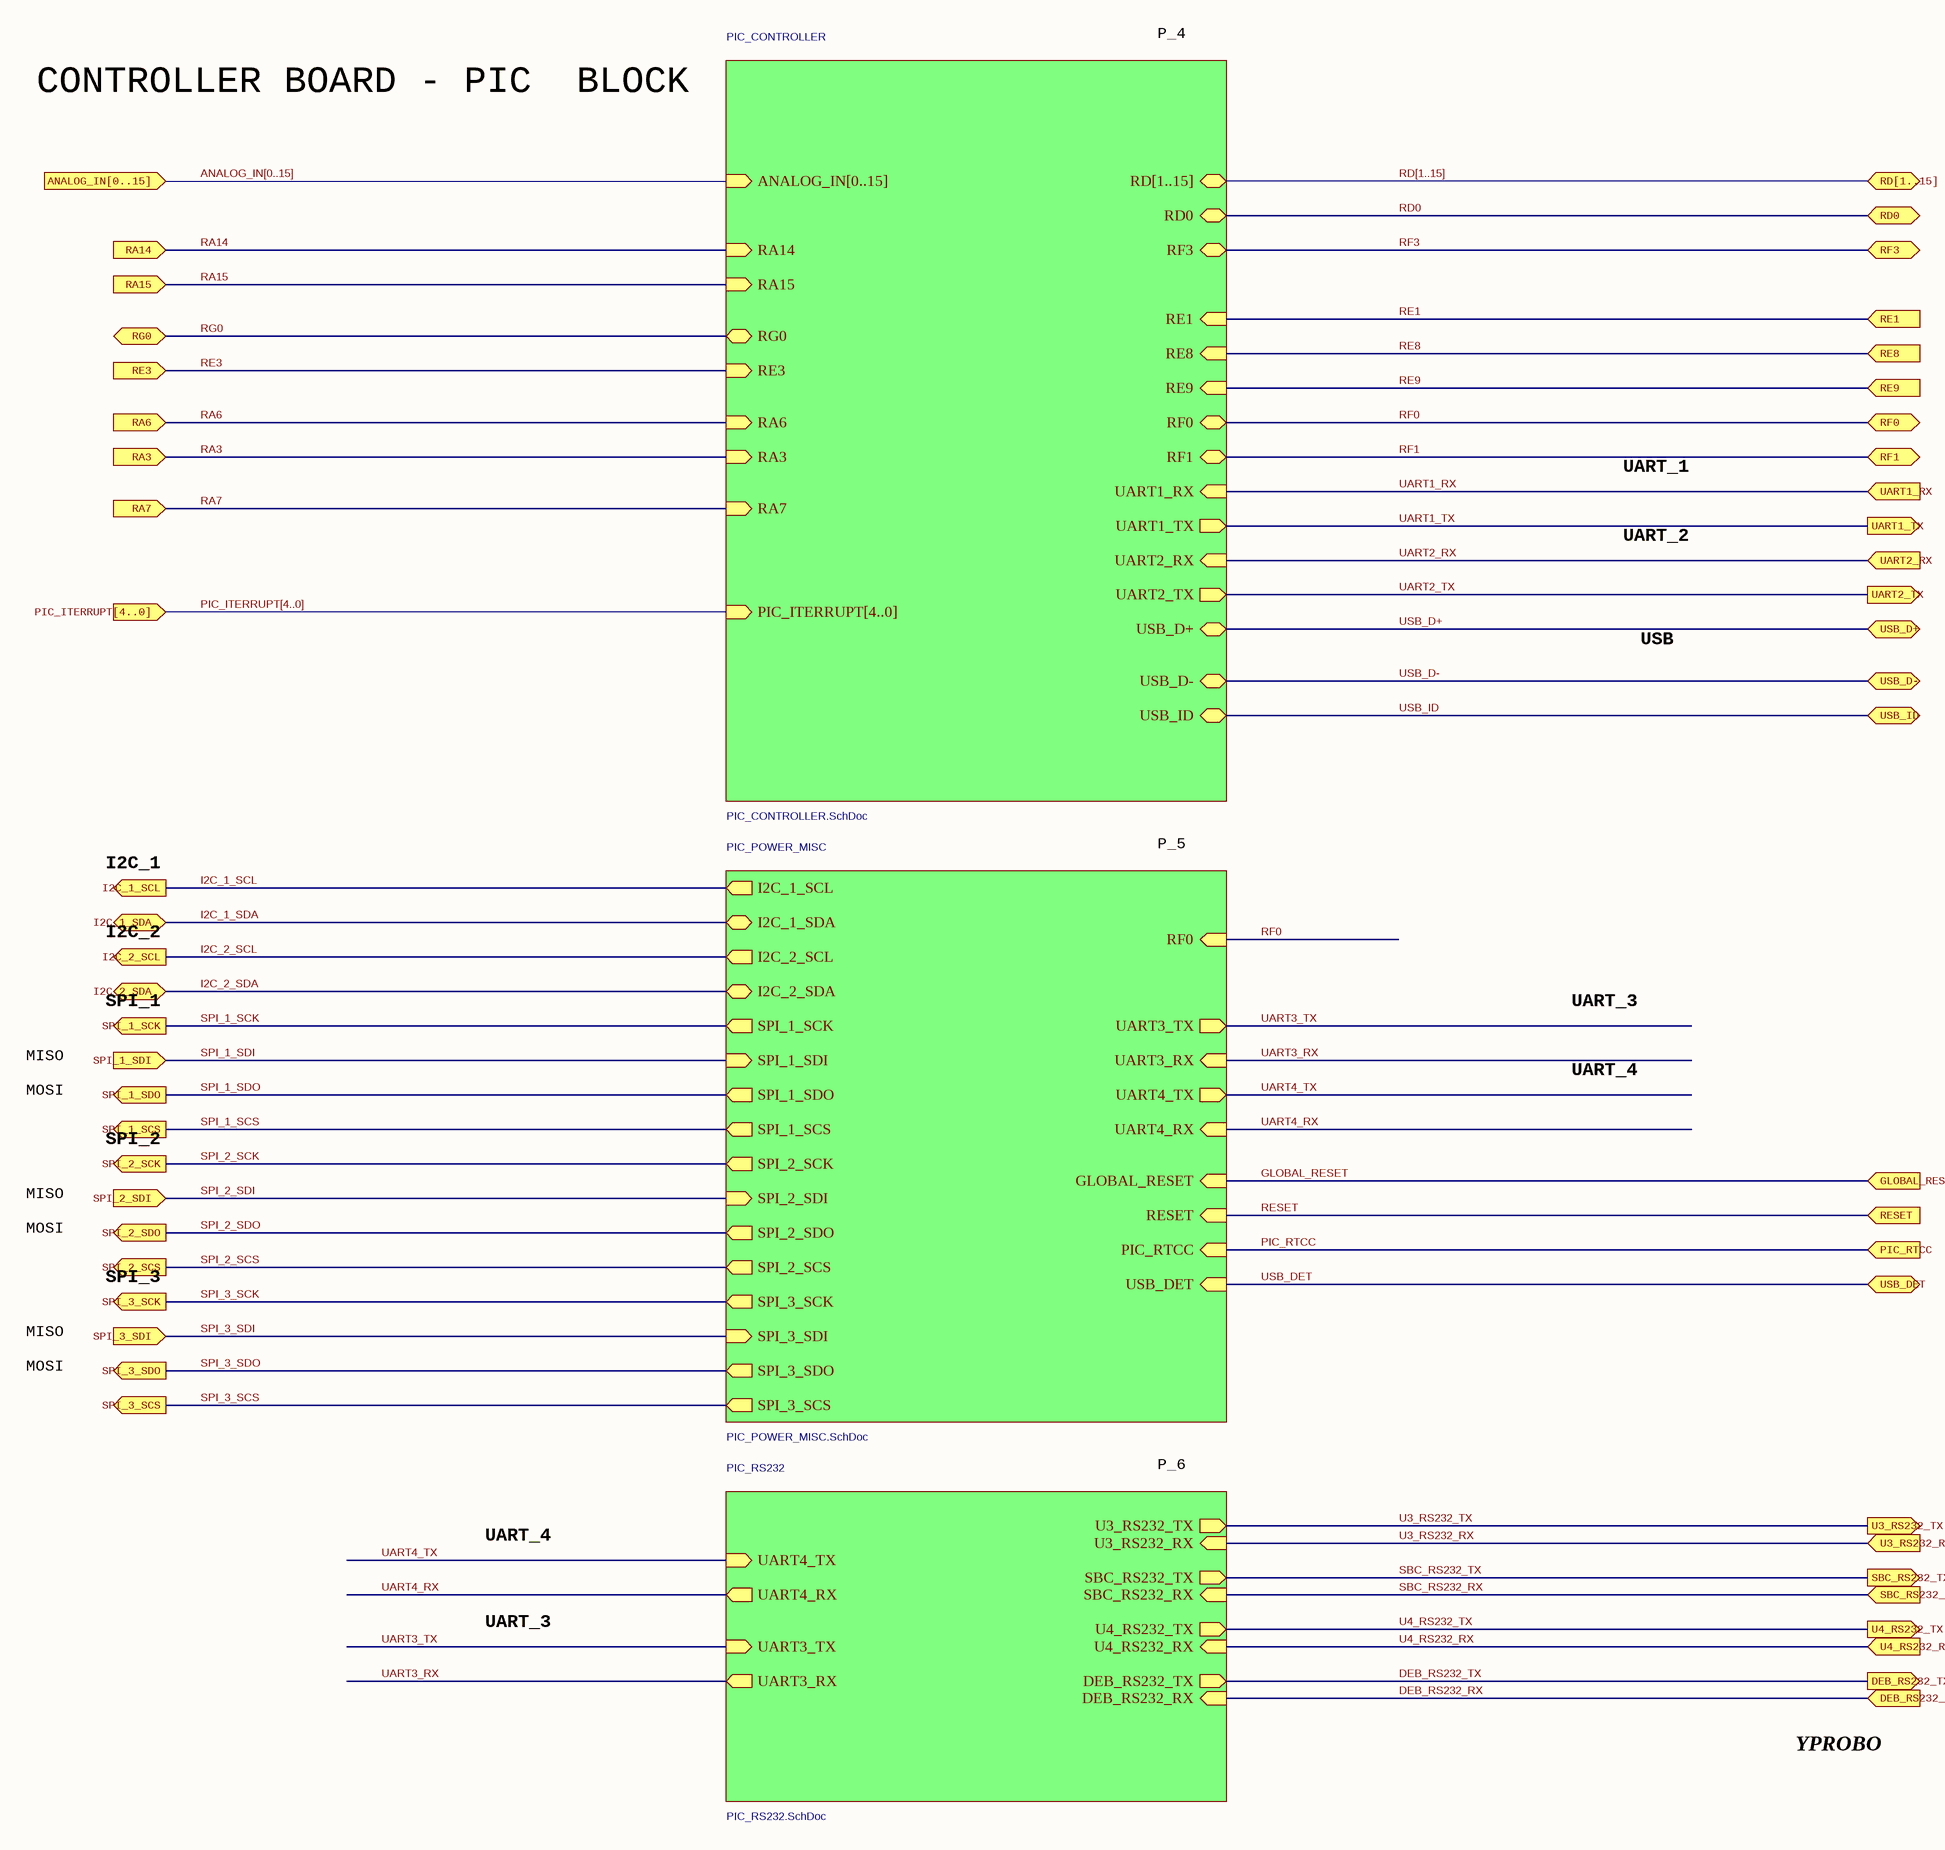
[diagram p7: PIC_BLOCK.SchDoc]

### Sub-sheets
PIC_CONTROLLER = PIC_CONTROLLER.SchDoc: RF0 (bidir), RF1 (bidir), RF3 (bidir), USB_ID (bidir), USB_D+ (bidir), USB_D- (bidir), RE1 (in), RE3 (in), RE8 (in), RE9 (in), RA6 (in), RA7 (in), RA3 (in), RA14 (in), RA15 (in), RD0 (bidir), PIC_ITERRUPT[4..0] (in), UART1_RX (in), UART2_RX (in), UART1_TX (out), UART2_TX (out), RG0 (bidir), ANALOG_IN[0..15] (in), RD[1..15] (bidir)
PIC_POWER_MISC = PIC_POWER_MISC.SchDoc: PIC_RTCC (in), GLOBAL_RESET (in), SPI_3_SDO (out), SPI_3_SCS (out), SPI_3_SDI (in), SPI_3_SCK (out), SPI_2_SDO (out), SPI_2_SCS (out), SPI_2_SDI (in), SPI_2_SCK (out), UART4_RX (in), UART4_TX (out), UART3_RX (in), UART3_TX (out), RESET (in), USB_DET (in), I2C_2_SDA (bidir), I2C_1_SDA (bidir), I2C_2_SCL (out), I2C_1_SCL (out), SPI_1_SDO (out), SPI_1_SCS (out), SPI_1_SDI (in), SPI_1_SCK (out), RF0 (in)
PIC_RS232 = PIC_RS232.SchDoc: SBC_RS232_TX (out), SBC_RS232_RX (in), DEB_RS232_TX (out), DEB_RS232_RX (in), UART4_RX (out), UART4_TX (in), UART3_RX (out), UART3_TX (in), U3_RS232_TX (out), U4_RS232_TX (out), U3_RS232_RX (in), U4_RS232_RX (in)

### Ports
ANALOG_IN[0..15] (in), DEB_RS232_RX (in), DEB_RS232_TX (out), GLOBAL_RESET (in), I2C_1_SCL (out), I2C_1_SDA (bidir), I2C_2_SCL (out), I2C_2_SDA (bidir), PIC_ITERRUPT[4..0] (in), PIC_RTCC (in), RA3 (in), RA6 (in), RA7 (in), RA14 (in), RA15 (in), RD0 (bidir), RD[1..15] (bidir), RE1 (in), RE3 (in), RE8 (in), RE9 (in), RESET (in), RF0 (bidir), RF1 (bidir), RF3 (bidir), RG0 (bidir), SBC_RS232_RX (in), SBC_RS232_TX (out), SPI_1_SCK (out), SPI_1_SCS (out), SPI_1_SDI (in), SPI_1_SDO (out), SPI_2_SCK (out), SPI_2_SCS (out), SPI_2_SDI (in), SPI_2_SDO (out), SPI_3_SCK (out), SPI_3_SCS (out), SPI_3_SDI (in), SPI_3_SDO (out), U3_RS232_RX (in), U3_RS232_TX (out), U4_RS232_RX (in), U4_RS232_TX (out), UART1_RX (in), UART1_TX (out), UART2_RX (in), UART2_TX (out), USB_D+ (bidir), USB_D- (bidir), USB_DET (bidir), USB_ID (bidir)

### Nets
DEB_RS232_RX: port DEB_RS232_RX, sheet PIC_RS232/DEB_RS232_RX
DEB_RS232_TX: port DEB_RS232_TX, sheet PIC_RS232/DEB_RS232_TX
GLOBAL_RESET: port GLOBAL_RESET, sheet PIC_POWER_MISC/GLOBAL_RESET
I2C_1_SCL: port I2C_1_SCL, sheet PIC_POWER_MISC/I2C_1_SCL
I2C_1_SDA: port I2C_1_SDA, sheet PIC_POWER_MISC/I2C_1_SDA
I2C_2_SCL: port I2C_2_SCL, sheet PIC_POWER_MISC/I2C_2_SCL
I2C_2_SDA: port I2C_2_SDA, sheet PIC_POWER_MISC/I2C_2_SDA
PIC_RTCC: port PIC_RTCC, sheet PIC_POWER_MISC/PIC_RTCC
RA3: port RA3, sheet PIC_CONTROLLER/RA3
RA6: port RA6, sheet PIC_CONTROLLER/RA6
RA7: port RA7, sheet PIC_CONTROLLER/RA7
RA14: port RA14, sheet PIC_CONTROLLER/RA14
RA15: port RA15, sheet PIC_CONTROLLER/RA15
RD0: port RD0, sheet PIC_CONTROLLER/RD0
RE1: port RE1, sheet PIC_CONTROLLER/RE1
RE3: port RE3, sheet PIC_CONTROLLER/RE3
RE8: port RE8, sheet PIC_CONTROLLER/RE8
RE9: port RE9, sheet PIC_CONTROLLER/RE9
RESET: port RESET, sheet PIC_POWER_MISC/RESET
RF0: port RF0, sheet PIC_CONTROLLER/RF0, sheet PIC_POWER_MISC/RF0
RF1: port RF1, sheet PIC_CONTROLLER/RF1
RF3: port RF3, sheet PIC_CONTROLLER/RF3
RG0: port RG0, sheet PIC_CONTROLLER/RG0
SBC_RS232_RX: port SBC_RS232_RX, sheet PIC_RS232/SBC_RS232_RX
SBC_RS232_TX: port SBC_RS232_TX, sheet PIC_RS232/SBC_RS232_TX
SPI_1_SCK: port SPI_1_SCK, sheet PIC_POWER_MISC/SPI_1_SCK
SPI_1_SCS: port SPI_1_SCS, sheet PIC_POWER_MISC/SPI_1_SCS
SPI_1_SDI: port SPI_1_SDI, sheet PIC_POWER_MISC/SPI_1_SDI
SPI_1_SDO: port SPI_1_SDO, sheet PIC_POWER_MISC/SPI_1_SDO
SPI_2_SCK: port SPI_2_SCK, sheet PIC_POWER_MISC/SPI_2_SCK
SPI_2_SCS: port SPI_2_SCS, sheet PIC_POWER_MISC/SPI_2_SCS
SPI_2_SDI: port SPI_2_SDI, sheet PIC_POWER_MISC/SPI_2_SDI
SPI_2_SDO: port SPI_2_SDO, sheet PIC_POWER_MISC/SPI_2_SDO
SPI_3_SCK: port SPI_3_SCK, sheet PIC_POWER_MISC/SPI_3_SCK
SPI_3_SCS: port SPI_3_SCS, sheet PIC_POWER_MISC/SPI_3_SCS
SPI_3_SDI: port SPI_3_SDI, sheet PIC_POWER_MISC/SPI_3_SDI
SPI_3_SDO: port SPI_3_SDO, sheet PIC_POWER_MISC/SPI_3_SDO
U3_RS232_RX: port U3_RS232_RX, sheet PIC_RS232/U3_RS232_RX
U3_RS232_TX: port U3_RS232_TX, sheet PIC_RS232/U3_RS232_TX
U4_RS232_RX: port U4_RS232_RX, sheet PIC_RS232/U4_RS232_RX
U4_RS232_TX: port U4_RS232_TX, sheet PIC_RS232/U4_RS232_TX
UART1_RX: port UART1_RX, sheet PIC_CONTROLLER/UART1_RX
UART1_TX: port UART1_TX, sheet PIC_CONTROLLER/UART1_TX
UART2_RX: port UART2_RX, sheet PIC_CONTROLLER/UART2_RX
UART2_TX: port UART2_TX, sheet PIC_CONTROLLER/UART2_TX
UART3_RX: sheet PIC_RS232/UART3_RX, sheet PIC_POWER_MISC/UART3_RX
UART3_TX: sheet PIC_RS232/UART3_TX, sheet PIC_POWER_MISC/UART3_TX
UART4_RX: sheet PIC_RS232/UART4_RX, sheet PIC_POWER_MISC/UART4_RX
UART4_TX: sheet PIC_RS232/UART4_TX, sheet PIC_POWER_MISC/UART4_TX
USB_D+: port USB_D+, sheet PIC_CONTROLLER/USB_D+
USB_D-: port USB_D-, sheet PIC_CONTROLLER/USB_D-
USB_DET: port USB_DET, sheet PIC_POWER_MISC/USB_DET
USB_ID: port USB_ID, sheet PIC_CONTROLLER/USB_ID

### Buses and harness runs
bus ANALOG_IN[0..15] = port ANALOG_IN[0..15] = sheet PIC_CONTROLLER/ANALOG_IN[0..15]
bus PIC_ITERRUPT[4..0] = port PIC_ITERRUPT[4..0] = sheet PIC_CONTROLLER/PIC_ITERRUPT[4..0]
bus RD[1..15] = port RD[1..15] = sheet PIC_CONTROLLER/RD[1..15]

### Notes on the sheet
- P_4
- CONTROLLER BOARD - PIC  BLOCK
- UART_1
- UART_2
- USB
- I2C_1
- P_5
- I2C_2
- MISO
- SPI_1
- UART_3
- UART_4
- MOSI
- SPI_2
- SPI_3
- P_6
- YPROBO
- Name
- Signature
- Date
- File:
- Board Name:
- Description:
- Document Version:
- Sheet
- of
- Approved
- Reviewed
- Designed
- This drawing and any accompanying documents contain confidential information intended for a specific individual and purpose.
  This information, owned by Lightsense, is private and confidential. If you are not the intended recipient, you are hereby notified that any disclosure, copying or distribution, or the taking of any action based on the contents of this information, is strictly prohibited.

## Sheet PIC_RS232.SchDoc
size A3; ApprovedBy: D. Grossman; CheckedBy: G. Engel; Author: Y. Yakov; CompanyName: LightSense; DrawnBy: Y. Yakov; Engineer: Y.Yakov; Organization: LightSense
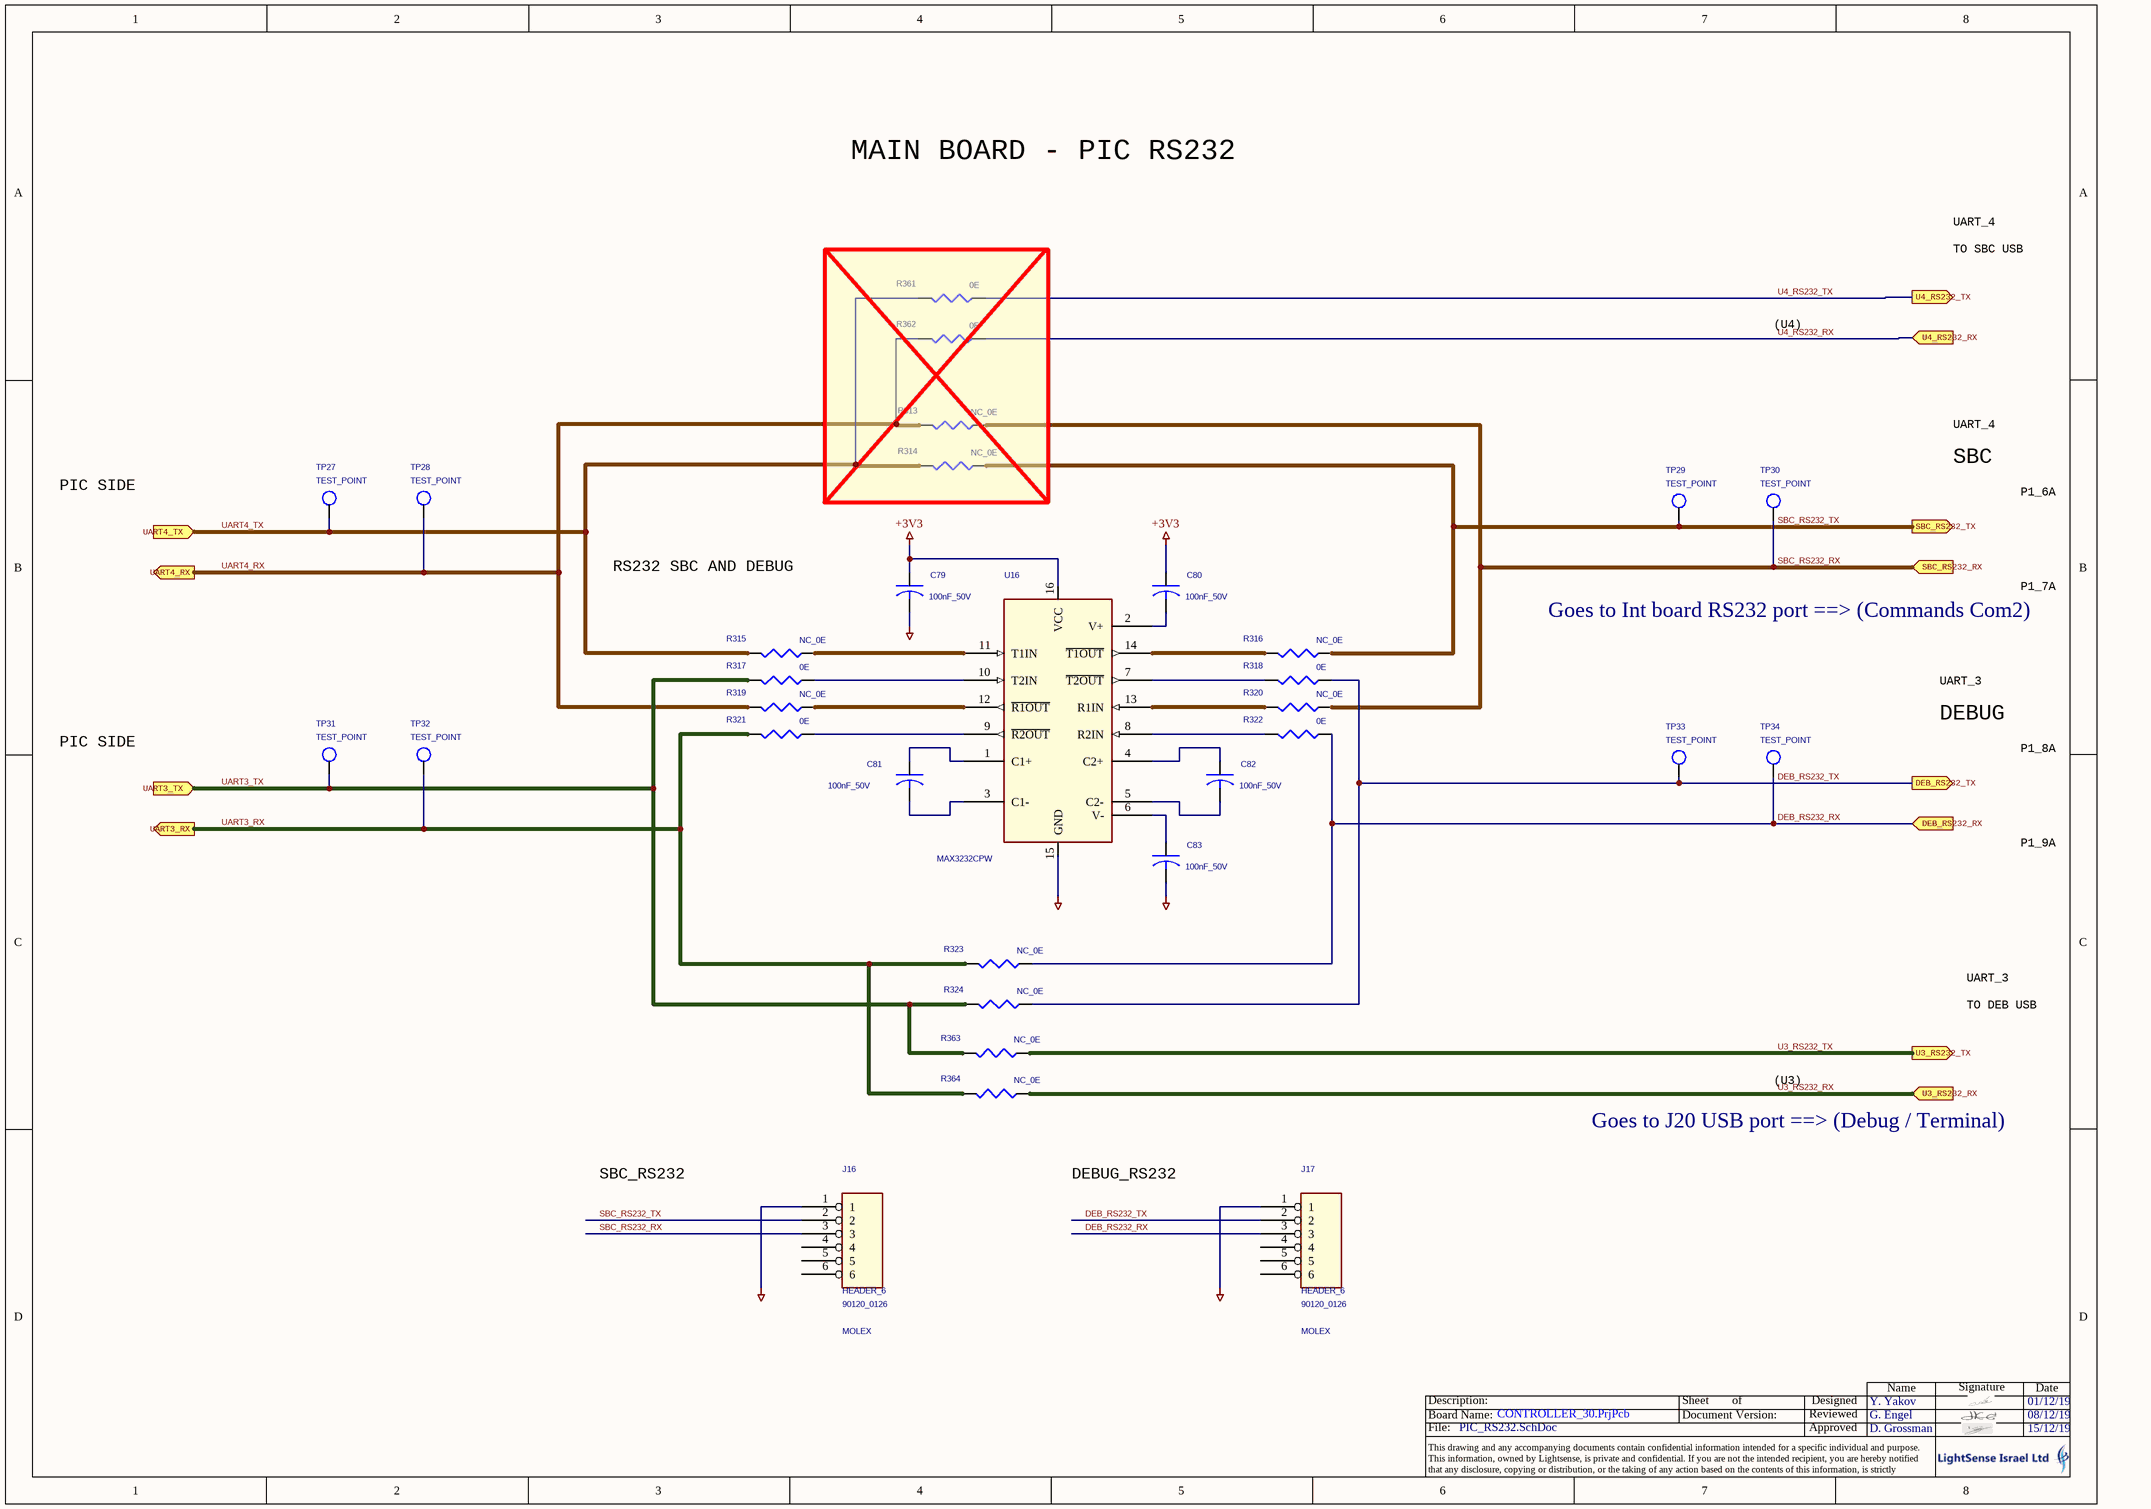
[diagram p8: PIC_RS232.SchDoc]

### Parts
C79  100nF_50V  [0603]
C80  100nF_50V  [0603]
C81  100nF_50V  [0603]
C82  100nF_50V  [0603]
C83  100nF_50V  [0603]
J16  HEADER_6  MFG: MOLEX  MFG_PN: 90120_0126  [HEADER_6PIN_100mil]
J17  HEADER_6  MFG: MOLEX  MFG_PN: 90120_0126  [HEADER_6PIN_100mil]
R313  NC_0E  [0603]
R314  NC_0E  [0603]
R315  NC_0E  [0603]
R316  NC_0E  [0603]
R317  0E  [0603]
R318  0E  [0603]
R319  NC_0E  [0603]
R320  NC_0E  [0603]
R321  0E  [0603]
R322  0E  [0603]
R323  NC_0E  [0603]
R324  NC_0E  [0603]
R361  0E  [0603]
R362  0E  [0603]
R363  NC_0E  [0603]
R364  NC_0E  [0603]
TP27  TEST_POINT  [TH_1mm]
TP28  TEST_POINT  [TH_1mm]
TP29  TEST_POINT  [TH_1mm]
TP30  TEST_POINT  [TH_1mm]
TP31  TEST_POINT  [TH_1mm]
TP32  TEST_POINT  [TH_1mm]
TP33  TEST_POINT  [TH_1mm]
TP34  TEST_POINT  [TH_1mm]
U16  MAX3232CPW  [TSSOP_16]

### Ports
DEB_RS232_RX (in), DEB_RS232_TX (out), SBC_RS232_RX (in), SBC_RS232_TX (out), U3_RS232_RX (in), U3_RS232_TX (out), U4_RS232_RX (in), U4_RS232_TX (out), UART3_RX (out), UART3_TX (in), UART4_RX (out), UART4_TX (in)

### Nets
+3V3: C79.1 C80.1 U16.16(VCC)
GND_CPU: C79.2 C83.2 J16.1 J17.1 U16.15(GND)
DEB_RS232_RX: J17.3 R322.1 R323.1 TP34.1(TP) ; port DEB_RS232_RX
DEB_RS232_TX: J17.2 R318.1 R324.1 TP33.1(TP) ; port DEB_RS232_TX
SBC_RS232_RX: J16.3 R313.1 R320.1 TP30.1(TP) ; port SBC_RS232_RX
SBC_RS232_TX: J16.2 R314.1 R316.1 TP29.1(TP) ; port SBC_RS232_TX
U3_RS232_RX: R364.1 ; port U3_RS232_RX
U3_RS232_TX: R363.1 ; port U3_RS232_TX
U4_RS232_RX: R362.1 ; port U4_RS232_RX
U4_RS232_TX: R361.1 ; port U4_RS232_TX
UART3_RX: R321.2 R323.2 R364.2 TP32.1(TP) ; port UART3_RX
UART3_TX: R317.2 R324.2 R363.2 TP31.1(TP) ; port UART3_TX
UART4_RX: R313.2 R319.2 R362.2 TP28.1(TP) ; port UART4_RX
UART4_TX: R314.2 R315.2 R361.2 TP27.1(TP) ; port UART4_TX
NetC80_2: C80.2 U16.2(V+)
NetC81_1: C81.1 U16.1(C1+)
NetC81_2: C81.2 U16.3(C1-)
NetC82_1: C82.1 U16.4(C2+)
NetC82_2: C82.2 U16.5(C2-)
NetC83_1: C83.1 U16.6(V-)
NetR315_1: R315.1 U16.11(T1IN)
NetR316_2: R316.2 U16.14(~{T1OUT})
NetR317_1: R317.1 U16.10(T2IN)
NetR318_2: R318.2 U16.7(~{T2OUT})
NetR319_1: R319.1 U16.12(~{R1OUT})
NetR320_2: R320.2 U16.13(R1IN)
NetR321_1: R321.1 U16.9(~{R2OUT})
NetR322_2: R322.2 U16.8(R2IN)

Not connected (* = marked no-connect by the designer): J16 4 5 6; J17 4 5 6

### Notes on the sheet
- MAIN BOARD - PIC RS232
- UART_4
- TO SBC USB
- (U4)
- PIC SIDE
- SBC
- P1_6A
- RS232 SBC AND DEBUG
- Goes to Int board RS232 port ==> (Commands Com2)
- P1_7A
- DEBUG
- UART_3
- P1_8A
- P1_9A
- TO DEB USB
- (U3)
- SBC_RS232
- DEBUG_RS232
- Goes to J20 USB port ==> (Debug / Terminal)
- Name
- Signature
- Date
- File:
- Board Name:
- Description:
- Document Version:
- Sheet
- of
- Approved
- Reviewed
- Designed
- This drawing and any accompanying documents contain confidential information intended for a specific individual and purpose.
  This information, owned by Lightsense, is private and confidential. If you are not the intended recipient, you are hereby notified that any disclosure, copying or distribution, or the taking of any action based on the contents of this information, is strictly prohibited.

### Library data of the parts
C79 C81 C82 = C: as C114 on sheet USB
C80 C83 = C: as C113 on sheet USB
J16 J17 = HEADER 6
R313-R315 R320-R322 R324 R361 R362 = R_Dup1: MFG_PN: RC0603FR-070R00L; MFG: YAGEO
R316-R319 R323 R363 R364 = R_Dup1: MFG: YAGEO; MFG_PN: RC0603FR-070R00L
TP27-TP34 = T POINT R_Dup1
U16 = MAX3232ESE_0: MFG: TI; MFG_PN: MAX3232CPW

## Sheet PIC_CONTROLLER.SchDoc
size A3; ApprovedBy: D. Grossman; CheckedBy: G. Engel; Author: Y. Yakov; CompanyName: LightSense; DrawnBy: Y. Yakov; Engineer: Y.Yakov; Organization: LightSense
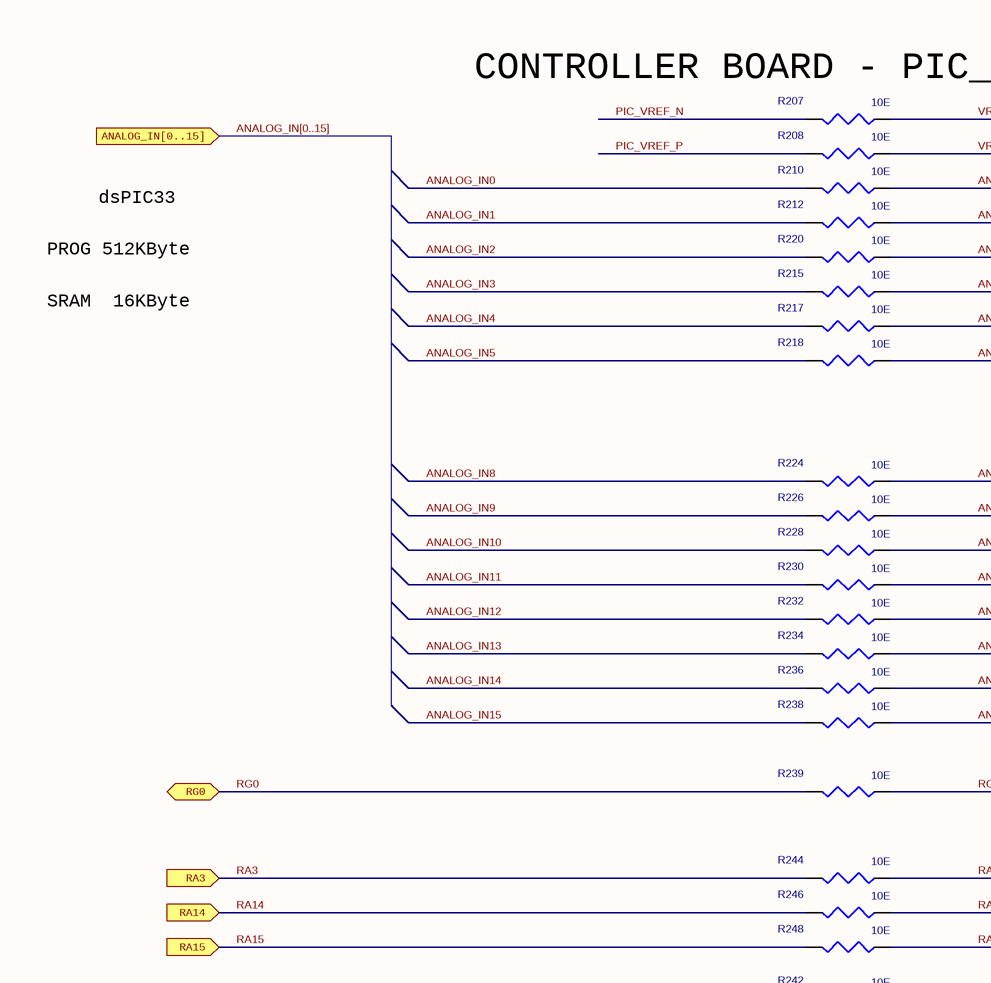
[diagram p9: PIC_CONTROLLER.SchDoc, top left]
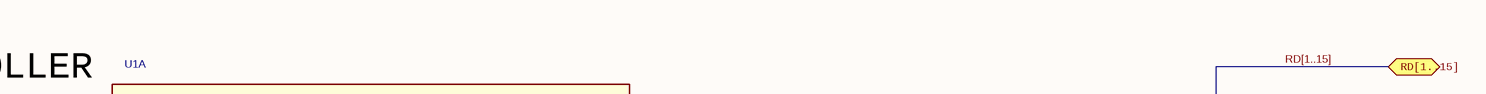
[diagram p10: PIC_CONTROLLER.SchDoc, top right]
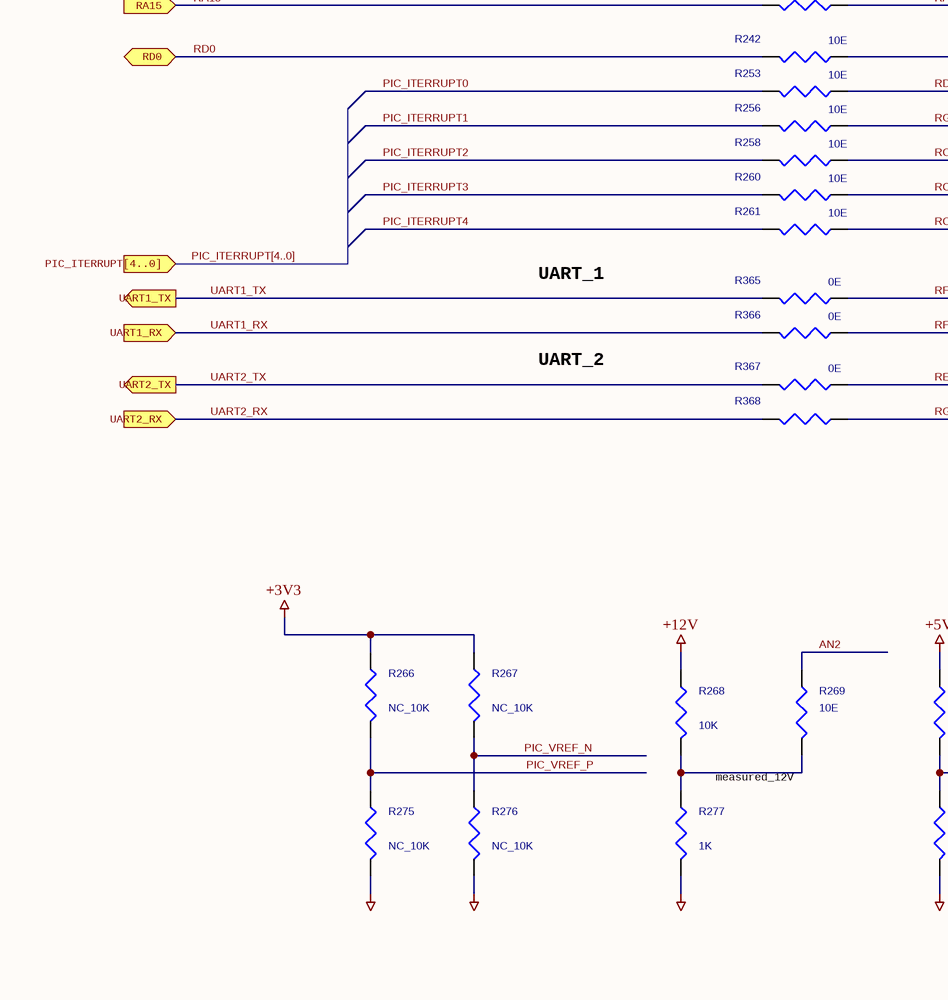
[diagram p11: PIC_CONTROLLER.SchDoc, bottom left]
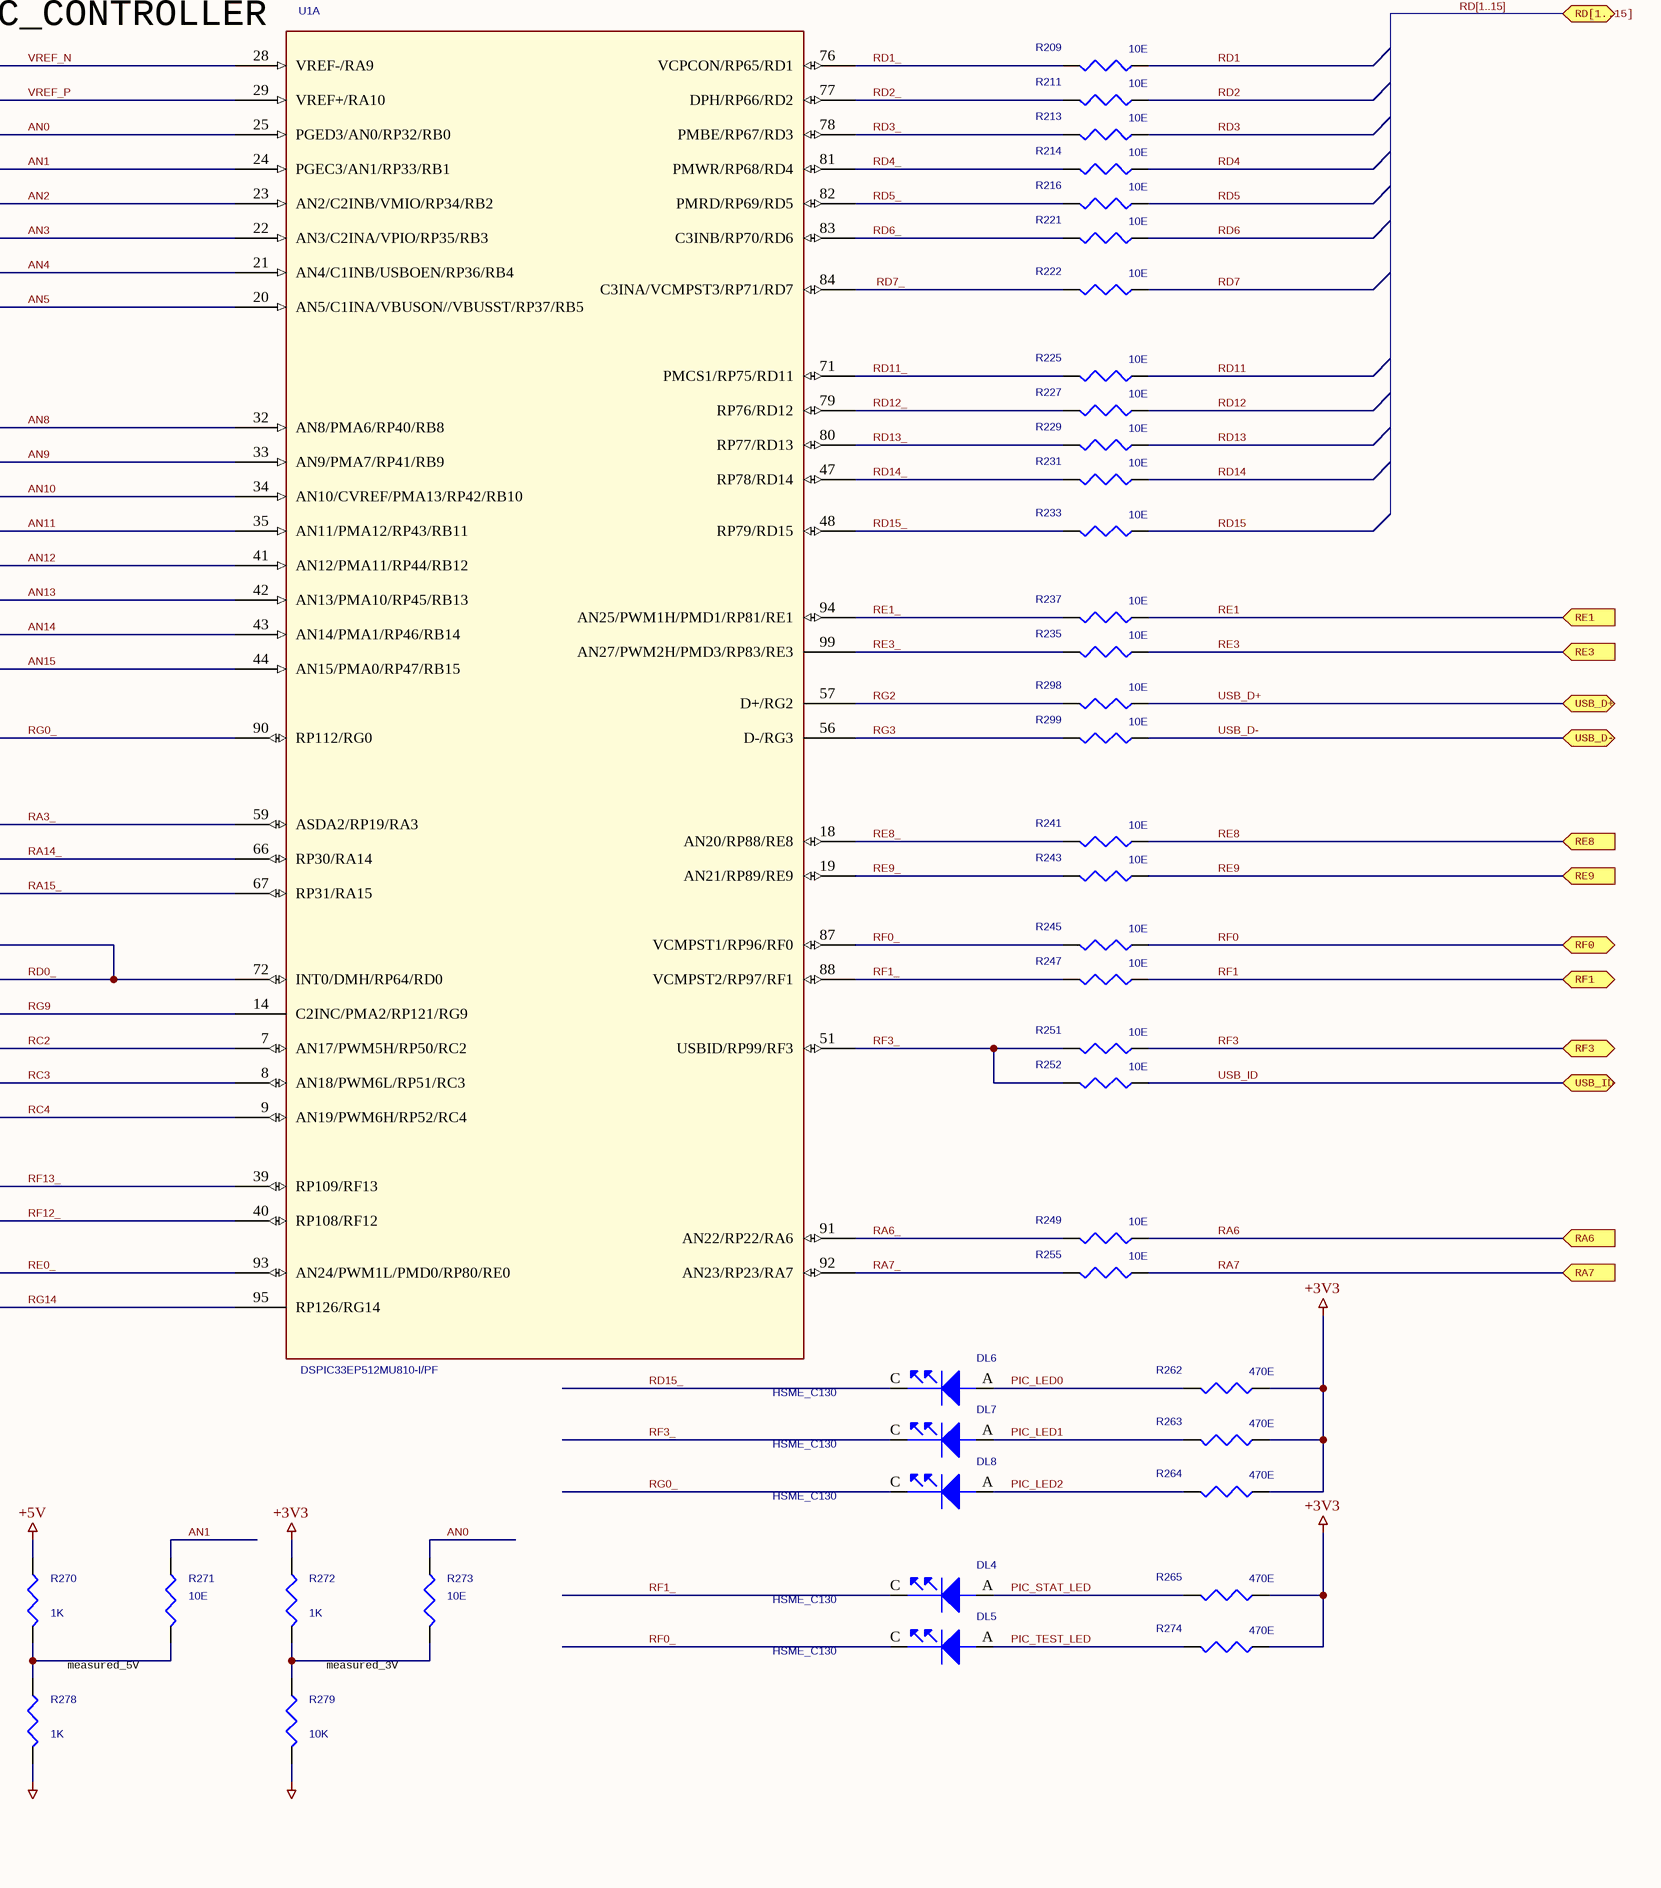
[diagram p12: PIC_CONTROLLER.SchDoc, bottom right]

### Parts
DL4  HSME_C130  [LED_0603]
DL5  HSME_C130  [LED_0603]
DL6  HSME_C130  [LED_0603]
DL7  HSME_C130  [LED_0603]
DL8  HSME_C130  [LED_0603]
R207  10E  [0603]
R208  10E  [0603]
R209  10E  [0603]
R210  10E  [0603]
R211  10E  [0603]
R212  10E  [0603]
R213  10E  [0603]
R214  10E  [0603]
R215  10E  [0603]
R216  10E  [0603]
R217  10E  [0603]
R218  10E  [0603]
R220  10E  [0603]
R221  10E  [0603]
R222  10E  [0603]
R224  10E  [0603]
R225  10E  [0603]
R226  10E  [0603]
R227  10E  [0603]
R228  10E  [0603]
R229  10E  [0603]
R230  10E  [0603]
R231  10E  [0603]
R232  10E  [0603]
R233  10E  [0603]
R234  10E  [0603]
R235  10E  [0603]
R236  10E  [0603]
R237  10E  [0603]
R238  10E  [0603]
R239  10E  [0603]
R241  10E  [0603]
R242  10E  [0603]
R243  10E  [0603]
R244  10E  [0603]
R245  10E  [0603]
R246  10E  [0603]
R247  10E  [0603]
R248  10E  [0603]
R249  10E  [0603]
R251  10E  [0603]
R252  10E  [0603]
R253  10E  [0603]
R255  10E  [0603]
R256  10E  [0603]
R258  10E  [0603]
R260  10E  [0603]
R261  10E  [0603]
R262  470E  [0603]
R263  470E  [0603]
R264  470E  [0603]
R265  470E  [0603]
R266  NC_10K  [0603]
R267  NC_10K  [0603]
R268  10K  [0603]
R269  10E  [0603]
R270  1K  [0603]
R271  10E  [0603]
R272  1K  [0603]
R273  10E  [0603]
R274  470E  [0603]
R275  NC_10K  [0603]
R276  NC_10K  [0603]
R277  1K  [0603]
R278  1K  [0603]
R279  10K  [0603]
R298  10E  [0603]
R299  10E  [0603]
R365  0E  [0603]
R366  0E  [0603]
R367  0E  [0603]
R368  0E  [0603]  (value not drawn)
U1  DSPIC33EP512MU810-I/PF  [TQFP_100]  (part A of 2)

### Ports
ANALOG_IN[0..15] (in), PIC_ITERRUPT[4..0] (in), RA3 (in), RA6 (in), RA7 (in), RA14 (in), RA15 (in), RD0 (bidir), RD[1..15] (bidir), RE1 (in), RE3 (in), RE8 (in), RE9 (in), RF0 (bidir), RF1 (bidir), RF3 (bidir), RG0 (bidir), UART1_RX (in), UART1_TX (out), UART2_RX (in), UART2_TX (out), USB_D+ (bidir), USB_D- (bidir), USB_ID (bidir)

### Nets
+3V3: R262.1 R263.1 R264.1 R265.1 R266.1 R267.1 R272.1 R274.1
+5V: R270.1
+12V: R268.1
GND_CPU: R275.2 R276.2 R277.2 R278.2 R279.2
AN0: R210.1 R273.1 U1.25(PGED3/AN0/RP32/RB0)
AN1: R212.1 R271.1 U1.24(PGEC3/AN1/RP33/RB1)
AN2: R220.1 R269.1 U1.23(AN2/C2INB/VMIO/RP34/RB2)
AN3: R215.1 U1.22(AN3/C2INA/VPIO/RP35/RB3)
AN4: R217.1 U1.21(AN4/C1INB/USBOEN/RP36/RB4)
AN5: R218.1 U1.20(AN5/C1INA/VBUSON//VBUSST/RP37/RB5)
AN8: R224.1 U1.32(AN8/PMA6/RP40/RB8)
AN9: R226.1 U1.33(AN9/PMA7/RP41/RB9)
AN10: R228.1 U1.34(AN10/CVREF/PMA13/RP42/RB10)
AN11: R230.1 U1.35(AN11/PMA12/RP43/RB11)
AN12: R232.1 U1.41(AN12/PMA11/RP44/RB12)
AN13: R234.1 U1.42(AN13/PMA10/RP45/RB13)
AN14: R236.1 U1.43(AN14/PMA1/RP46/RB14)
AN15: R238.1 U1.44(AN15/PMA0/RP47/RB15)
ANALOG_IN0: R210.2
ANALOG_IN1: R212.2
ANALOG_IN2: R220.2
ANALOG_IN3: R215.2
ANALOG_IN4: R217.2
ANALOG_IN5: R218.2
ANALOG_IN8: R224.2
ANALOG_IN9: R226.2
ANALOG_IN10: R228.2
ANALOG_IN11: R230.2
ANALOG_IN12: R232.2
ANALOG_IN13: R234.2
ANALOG_IN14: R236.2
ANALOG_IN15: R238.2
PIC_ITERRUPT0: R253.2
PIC_ITERRUPT1: R256.2
PIC_ITERRUPT2: R258.2
PIC_ITERRUPT3: R260.2
PIC_ITERRUPT4: R261.2
PIC_LED0: DL6.A(ANODE) R262.2
PIC_LED1: DL7.A(ANODE) R263.2
PIC_LED2: DL8.A(ANODE) R264.2
PIC_STAT_LED: DL4.A(ANODE) R265.2
PIC_TEST_LED: DL5.A(ANODE) R274.2
PIC_VREF_N: R207.2 R267.2 R276.1
PIC_VREF_P: R208.2 R266.2 R275.1
RA3: R244.2 ; port RA3
RA3_: R244.1 U1.59(ASDA2/RP19/RA3)
RA6: R249.1 ; port RA6
RA6_: R249.2 U1.91(AN22/RP22/RA6)
RA7: R255.1 ; port RA7
RA7_: R255.2 U1.92(AN23/RP23/RA7)
RA14: R246.2 ; port RA14
RA14_: R246.1 U1.66(RP30/RA14)
RA15: R248.2 ; port RA15
RA15_: R248.1 U1.67(RP31/RA15)
RC2: R258.1 U1.7(AN17/PWM5H/RP50/RC2)
RC3: R260.1 U1.8(AN18/PWM6L/RP51/RC3)
RC4: R261.1 U1.9(AN19/PWM6H/RP52/RC4)
RD0: R242.2 ; port RD0
RD0_: R242.1 R253.1 U1.72(INT0/DMH/RP64/RD0)
RD1: R209.1
RD1_: R209.2 U1.76(VCPCON/RP65/RD1)
RD2: R211.1
RD2_: R211.2 U1.77(DPH/RP66/RD2)
RD3: R213.1
RD3_: R213.2 U1.78(PMBE/RP67/RD3)
RD4: R214.1
RD4_: R214.2 U1.81(PMWR/RP68/RD4)
RD5: R216.1
RD5_: R216.2 U1.82(PMRD/RP69/RD5)
RD6: R221.1
RD6_: R221.2 U1.83(C3INB/RP70/RD6)
RD7: R222.1
RD7_: R222.2 U1.84(C3INA/VCMPST3/RP71/RD7)
RD11: R225.1
RD11_: R225.2 U1.71(PMCS1/RP75/RD11)
RD12: R227.1
RD12_: R227.2 U1.79(RP76/RD12)
RD13: R229.1
RD13_: R229.2 U1.80(RP77/RD13)
RD14: R231.1
RD14_: R231.2 U1.47(RP78/RD14)
RD15: R233.1
RD15_: DL6.C(CATHODE) R233.2 U1.48(RP79/RD15)
RE0_: R367.1 U1.93(AN24/PWM1L/PMD0/RP80/RE0)
RE1: R237.1 ; port RE1
RE1_: R237.2 U1.94(AN25/PWM1H/PMD1/RP81/RE1)
RE3: R235.1 ; port RE3
RE3_: R235.2 U1.99(AN27/PWM2H/PMD3/RP83/RE3)
RE8: R241.1 ; port RE8
RE8_: R241.2 U1.18(AN20/RP88/RE8)
RE9: R243.1 ; port RE9
RE9_: R243.2 U1.19(AN21/RP89/RE9)
RF0: R245.1 ; port RF0
RF0_: DL5.C(CATHODE) R245.2 U1.87(VCMPST1/RP96/RF0)
RF1: R247.1 ; port RF1
RF1_: DL4.C(CATHODE) R247.2 U1.88(VCMPST2/RP97/RF1)
RF3: R251.1 ; port RF3
RF3_: DL7.C(CATHODE) R251.2 R252.2 U1.51(USBID/RP99/RF3)
RF12_: R366.1 U1.40(RP108/RF12)
RF13_: R365.1 U1.39(RP109/RF13)
RG0: R239.2 ; port RG0
RG0_: DL8.C(CATHODE) R239.1 U1.90(RP112/RG0)
RG2: R298.2 U1.57(D+/RG2)
RG3: R299.2 U1.56(D-/RG3)
RG9: R256.1 U1.14(C2INC/PMA2/RP121/RG9)
RG14: R368.1 U1.95(RP126/RG14)
UART1_RX: R366.2 ; port UART1_RX
UART1_TX: R365.2 ; port UART1_TX
UART2_RX: R368.2 ; port UART2_RX
UART2_TX: R367.2 ; port UART2_TX
USB_D+: R298.1 ; port USB_D+
USB_D-: R299.1 ; port USB_D-
USB_ID: R252.1 ; port USB_ID
VREF_N: R207.1 U1.28(VREF-/RA9)
VREF_P: R208.1 U1.29(VREF+/RA10)
NetR268_2: R268.2 R269.2 R277.1
NetR270_2: R270.2 R271.2 R278.1
NetR272_2: R272.2 R273.2 R279.1

### Buses and harness runs
bus ANALOG_IN[0..15] = port ANALOG_IN[0..15]
bus PIC_ITERRUPT[4..0] = port PIC_ITERRUPT[4..0]
bus RD[1..15] = port RD[1..15]

### Notes on the sheet
- (near R207) CONTROLLER BOARD - PIC_CONTROLLER
- dsPIC33
- PROG 512KByte
- SRAM  16KByte
- UART_1
- UART_2
- measured_12V
- measured_5V
- measured_3V
- Name
- Signature
- Date
- File:
- Board Name:
- Description:
- Document Version:
- Sheet
- of
- Approved
- Reviewed
- Designed
- This drawing and any accompanying documents contain confidential information intended for a specific individual and purpose.
  This information, owned by Lightsense, is private and confidential. If you are not the intended recipient, you are hereby notified that any disclosure, copying or distribution, or the taking of any action based on the contents of this information, is strictly prohibited.

### Library data of the parts
DL4 DL5 = LED: Lumenis_P/N: EL0000123; MFG: AVAGO; MFG_PN: HSME_C130
DL6-DL8 = LED: MFG: AVAGO; Lumenis_P/N: EL0000123; MFG_PN: HSME_C130
R207-R209 R211 R213 R214 R216 R221 R222 R224-R228 R230 R232-R234 R236-R238 R241 R243 R244 R246 R248 R251 R253 R255 R269 R366 = R_Dup1: MFG_PN: RC0603FR-0710R0L; MFG: YAGEO
R210 R212 R215 R217 R218 R220 R229 R231 R235 R239 R242 R245 R247 R249 R252 R256 R258 R260 R261 R271 R273 R298 R299 R365 R367 R368 = R_Dup1: MFG: YAGEO; MFG_PN: RC0603FR-0710R0L
R262 R265 = R_Dup1: MFG: YAGEO; MFG_PN: RC0603FR-07470RL
R263 R264 R274 = R_Dup1: MFG_PN: RC0603FR-07470RL; MFG: YAGEO
R266 R268 R275 R279 = R_Dup1: MFG: YAGEO; MFG_PN: RC0603FR-0710K0L
R267 R276 = R_Dup1: MFG_PN: RC0603FR-0710K0L; MFG: YAGEO
R270 R278 = R_Dup1: MFG_PN: RC0603FR-071K00L; MFG: YAGEO
R272 R277 = R_Dup1: MFG: YAGEO; MFG_PN: RC0603FR-071K00L
U1 = DSPIC33EP512MU810-I/PF_0: MFG: MICROCHIP; MFG_PN: DSPIC33EP512MU810-I/PF